# Altium project Rock960 Cape.PrjPcb (part 2 of 2)

## Sheet DC-DC Converters.SchDoc: DC-DC Converters
size B; Organization: Drexel University; Address1: ECE Senior Design; Address2: 2018-2019; Address3: ECE-08; Revision: 1.0; SheetNumber: 7; SheetTotal: 9
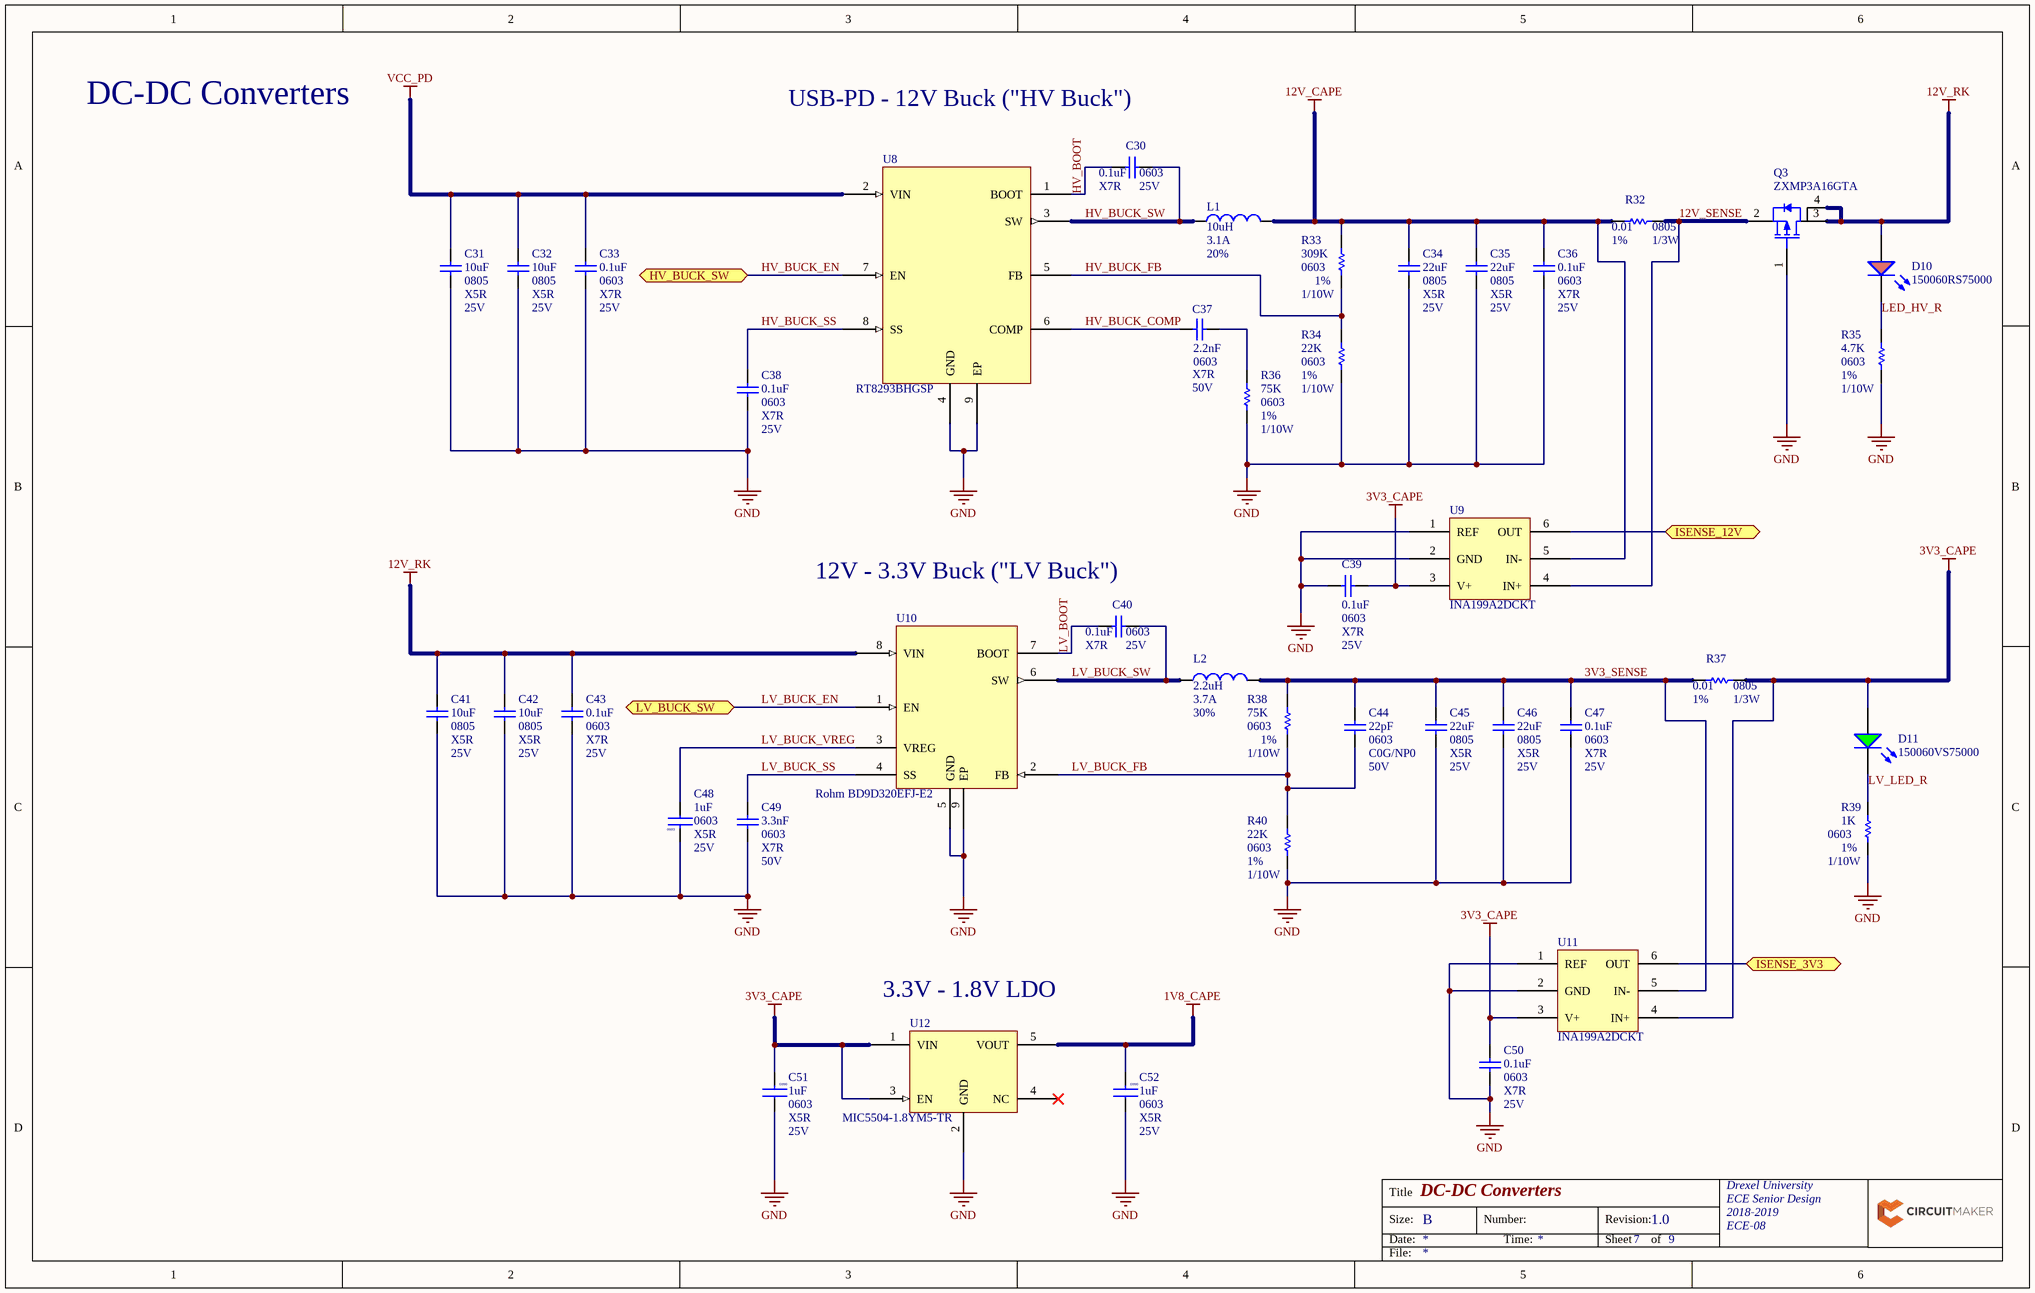
[diagram p6: DC-DC Converters.SchDoc]

### Parts
C30  Dielectric Characteristic: X7R  Voltage Rating (DC): 25V  Capacitance: 0.1uF  Package: 0603  [PCB-8usp83j76ntw2xroyu3n-1]  (hidden comment: Würth Elektronik 885012206071)
C31  Voltage Rating (DC): 25V  Package: 0805  Capacitance: 10uF  Temperature Coefficient: X5R  [Capacitor_0805]  (hidden comment: Murata GRM21BR61E106MA73L)
C32  Voltage Rating (DC): 25V  Package: 0805  Capacitance: 10uF  Temperature Coefficient: X5R  [Capacitor_0805]  (hidden comment: Murata GRM21BR61E106MA73L)
C33  Dielectric Characteristic: X7R  Voltage Rating (DC): 25V  Capacitance: 0.1uF  Package: 0603  [PCB-8usp83j76ntw2xroyu3n-1]  (hidden comment: Würth Elektronik 885012206071)
C34  Case/Package: 0805  Capacitance: 22uF  Temperature Coefficient: X5R  Voltage Rating: 25V  [PCB-sm9io2v4t6ucfy8bcald-1]  (hidden comment: CL21A226MAQNNNE)
C35  Case/Package: 0805  Capacitance: 22uF  Temperature Coefficient: X5R  Voltage Rating: 25V  [PCB-sm9io2v4t6ucfy8bcald-1]  (hidden comment: CL21A226MAQNNNE)
C36  Dielectric Characteristic: X7R  Voltage Rating (DC): 25V  Capacitance: 0.1uF  Package: 0603  [PCB-8usp83j76ntw2xroyu3n-1]  (hidden comment: Würth Elektronik 885012206071)
C37  Capacitance: 2.2nF  Pacakge: 0603  Temperature Coefficient: X7R  Voltage Rating: 50V  [PCB-rt9y6alohkqhfgbzbx9m-1]  (hidden comment: Cap)
C38  Dielectric Characteristic: X7R  Voltage Rating (DC): 25V  Capacitance: 0.1uF  Package: 0603  [PCB-8usp83j76ntw2xroyu3n-1]  (hidden comment: Würth Elektronik 885012206071)
C39  Dielectric Characteristic: X7R  Voltage Rating (DC): 25V  Capacitance: 0.1uF  Package: 0603  [PCB-8usp83j76ntw2xroyu3n-1]  (hidden comment: Würth Elektronik 885012206071)
C40  Dielectric Characteristic: X7R  Voltage Rating (DC): 25V  Capacitance: 0.1uF  Package: 0603  [PCB-8usp83j76ntw2xroyu3n-1]  (hidden comment: Würth Elektronik 885012206071)
C41  Voltage Rating (DC): 25V  Package: 0805  Capacitance: 10uF  Temperature Coefficient: X5R  [Capacitor_0805]  (hidden comment: Murata GRM21BR61E106MA73L)
C42  Voltage Rating (DC): 25V  Package: 0805  Capacitance: 10uF  Temperature Coefficient: X5R  [Capacitor_0805]  (hidden comment: Murata GRM21BR61E106MA73L)
C43  Dielectric Characteristic: X7R  Voltage Rating (DC): 25V  Capacitance: 0.1uF  Package: 0603  [PCB-8usp83j76ntw2xroyu3n-1]  (hidden comment: Würth Elektronik 885012206071)
C44  Capacitance: 22pF  Voltage Rating: 50V  Temperature Coefficient: C0G/NP0  Package: 0603  [PCB-c1bc5fz63nm5dhuj9x7i-1]  (hidden comment: Samsung CL10C220JB8NFNC)
C45  Case/Package: 0805  Capacitance: 22uF  Temperature Coefficient: X5R  Voltage Rating: 25V  [PCB-sm9io2v4t6ucfy8bcald-1]  (hidden comment: CL21A226MAQNNNE)
C46  Case/Package: 0805  Capacitance: 22uF  Temperature Coefficient: X5R  Voltage Rating: 25V  [PCB-sm9io2v4t6ucfy8bcald-1]  (hidden comment: CL21A226MAQNNNE)
C47  Dielectric Characteristic: X7R  Voltage Rating (DC): 25V  Capacitance: 0.1uF  Package: 0603  [PCB-8usp83j76ntw2xroyu3n-1]  (hidden comment: Würth Elektronik 885012206071)
C48  Case/Package: 0603  Dielectric Characteristic: X5R  Capacitance: 1uF  Voltage Rating (DC): 25V  [PCB-bncvufzharetcg4gy1u6-1]  (hidden comment: Taiyo Yuden TMK107BJ105KA-T)
C49  Capacitance: 3.3nF  Case/Package: 0603  Dielectric Characteristic: X7R  Voltage Rating (DC): 50V  [PCB-spmbmairbtzdei53y7wi-1]  (hidden comment: Würth Elektronik 885012206086)
C50  Dielectric Characteristic: X7R  Voltage Rating (DC): 25V  Capacitance: 0.1uF  Package: 0603  [PCB-8usp83j76ntw2xroyu3n-1]  (hidden comment: Würth Elektronik 885012206071)
C51  Case/Package: 0603  Dielectric Characteristic: X5R  Capacitance: 1uF  Voltage Rating (DC): 25V  [PCB-bncvufzharetcg4gy1u6-1]  (hidden comment: Taiyo Yuden TMK107BJ105KA-T)
C52  Case/Package: 0603  Dielectric Characteristic: X5R  Capacitance: 1uF  Voltage Rating (DC): 25V  [PCB-bncvufzharetcg4gy1u6-1]  (hidden comment: Taiyo Yuden TMK107BJ105KA-T)
D10  150060RS75000  [PCB-gaza7c7mdlgwi4y82xs2-1]
D11  150060VS75000  [0603_A]
L1  Inductance: 10uH  Current Rating: 3.1A  Tolerance: 20%  [Inductor]  (hidden comment: Inductor)
L2  Inductance: 2.2uH  Current Rating: 3.7A  Tolerance: 30%  [PCB-fuzgio0l72uhvfuauccx-1]  (hidden comment: Inductor)
Q3  Manufacturer Part Number: ZXMP3A16GTA  [SOT230P700X160-4N]  (hidden comment: SYM-6957a0575e87b690-1)
R32  Package: 0805  Power Rating: 1/3W  Resistance: 0.01  Tolerance: 1%  [PCB-5x7ab7seay4cz0nm4g1d-1]  (hidden comment: RU2012FR010CS)
R33  Case/Package: 0603  Power Rating: 1/10W  Resistance: 309K  Resistance Tolerance: 1%  [RESC1608X55X25LL10T15]  (hidden comment: Yageo RC0603FR-07309KL)
R34  Resistance: 22K  Resistance Tolerance: 1%  Case/Package: 0603  Power Rating: 1/10W  [RESC1608X55X25LL10T15]  (hidden comment: Yageo RC0603FR-0722KL)
R35  Resistance: 4.7K  Package: 0603  Power Rating: 1/10W  Tolerance: 1%  [CAPC1608X90X35NL15T15]  (hidden comment: 4k7)
R36  Case/Package: 0603  Resistance: 75K  Resistance Tolerance: 1%  Power: 1/10W  [BOUR-CR0603-FX-7502ELF_M]  (hidden comment: Bourns CR0603-FX-7502ELF)
R37  Package: 0805  Power Rating: 1/3W  Resistance: 0.01  Tolerance: 1%  [PCB-5x7ab7seay4cz0nm4g1d-1]  (hidden comment: RU2012FR010CS)
R38  Case/Package: 0603  Resistance: 75K  Resistance Tolerance: 1%  Power: 1/10W  [BOUR-CR0603-FX-7502ELF_M]  (hidden comment: Bourns CR0603-FX-7502ELF)
R39  Case/Package: 0603  Power Rating: 1/10W  Resistance: 1K  Resistance Tolerance: 1%  [PCB-rzdzs5ckhrcob8ss0hvn-1]  (hidden comment: Stackpole Electronics RMCF0603FT1K00)
R40  Resistance: 22K  Resistance Tolerance: 1%  Case/Package: 0603  Power Rating: 1/10W  [RESC1608X55X25LL10T15]  (hidden comment: Yageo RC0603FR-0722KL)
U8  RT8293BHGSP  [SOP127P600X175_HS-9N]
U9  INA199A2DCKT  [PCB-fk4u5s6fuzak3ls58m4h-1]
U10  Rohm BD9D320EFJ-E2  [TSOP127P600X100_HS-9N]
U11  INA199A2DCKT  [PCB-fk4u5s6fuzak3ls58m4h-1]
U12  MIC5504-1.8YM5-TR  [PCB-iw8x523xp2xa24mrz5ek-1]

### Ports
HV_BUCK_SW, ISENSE_3V3, ISENSE_12V, LV_BUCK_SW

### Nets
1V8_CAPE: C52.2 U12.5(VOUT)
3V3_CAPE: C39.2 C50.2 C51.2 D11.2(A) R37.2 U9.3(V+) U11.3(V+) U11.4(IN+) U12.1(VIN) U12.3(EN)
12V_CAPE: C34.1 C35.1 C36.2 L1.2 R32.1 R33.2 U9.5(IN-)
12V_RK: C41.2 C42.2 C43.2 D10.2(A) Q3.3(D) Q3.4 U10.8(VIN)
GND: C31.1 C32.1 C33.1 C34.2 C35.2 C36.1 C38.1 C39.1 C41.1 C42.1 C43.1 C45.2 C46.2 C47.1 C48.2 C49.1 C50.1 C51.1 C52.1 Q3.1(G) R34.1 R35.1 R36.1 R39.1 R40.1 U8.4(GND) U8.9(EP) U9.1(REF) U9.2(GND) U10.5(GND) U10.9(EP) U11.1(REF) U11.2(GND) U12.2(GND)
VCC_PD: C31.2 C32.2 C33.2 U8.2(VIN)
3V3_SENSE: C44.2 C45.1 C46.1 C47.2 L2.2 R37.1 R38.2 U11.5(IN-)
12V_SENSE: Q3.2(S) R32.2 U9.4(IN+)
AP_PA5_ADC1_5: U9.6(OUT) ; port ISENSE_12V
AP_PB1_ADC1_9: U11.6(OUT) ; port ISENSE_3V3
HV_BOOT: C30.1 U8.1(BOOT)
HV_BUCK_COMP: C37.2 U8.6(COMP)
HV_BUCK_EN: U8.7(EN) ; port HV_BUCK_SW
HV_BUCK_FB: R33.1 R34.2 U8.5(FB)
HV_BUCK_SS: C38.2 U8.8(SS)
HV_BUCK_SW: C30.2 L1.1 U8.3(SW)
LED_HV_R: D10.1(K) R35.2
LV_BOOT: C40.1 U10.7(BOOT)
LV_BUCK_EN: U10.1(EN) ; port LV_BUCK_SW
LV_BUCK_FB: C44.1 R38.1 R40.2 U10.2(FB)
LV_BUCK_SS: C49.2 U10.4(SS)
LV_BUCK_SW: C40.2 L2.1 U10.6(SW)
LV_BUCK_VREG: C48.1 U10.3(VREG)
LV_LED_R: D11.1(K) R39.2
NetC37_1: C37.1 R36.2

Not connected (* = marked no-connect by the designer): U12 4(NC)*

### Notes on the sheet
- DC-DC Converters
- USB-PD - 12V Buck ("HV Buck")
- (near C40) 12V - 3.3V Buck ("LV Buck")
- (near U12) 3.3V - 1.8V LDO
- Title
- Size:
- Date:
- B
- Number:
- Time:
- Revision:
- Sheet
- of
- File:

### Library data of the parts
C30 C33 C36 C38-C40 C43 C47 C50 = CMP-034ac9768ab0dc8d-1: as C59 on sheet IO Level Shifters; RoHS: Compliant; Capacitance Tolerance: ±10%; OctopartID: 034ac9768ab0dc8d; Packaging: Cut Tape (CT); Octopart URL: http://octopart.com/885012206071-w%C3%BCrth+elektronik-53914780; Manufacturer Part Number: 885012206071
C31 C32 C41 C42 = CMP-3dadf66f6462e26a-3: 0805 25 V 10 uF ±20% Tolerance X5R Multilayer Ceramic Capacitor; Case/Package (SI): 2012; Size-Length: 2.00 mm; OctopartID: 3dadf66f6462e26a; RoHS: Compliant; Lifecycle Status: Active
C34 C35 C45 C46 = CMP-38b9f0cfc974e77e-4: Cap Multilayer Ceramic 0805 22uF 25V ±20% X5R CL21 Series; Lead-Free Status: Lead Free; Capacitance Tolerance: ±20%; Octopart URL: https://octopart.com/cl21a226maqnnne-samsung-24958123; Mounting Style: Surface Mount; Packaging: Tape & Reel (TR)
C37 = CMP-41698a7525199eae-1: Cap Ceramic 0.0022uF 50V X7R 10% SMD 0603 OMD-CAP with FlexiTerm 125C T/R; Octopart URL: https://octopart.com/cl10b222kb8wpnc-samsung-35012886
C44 = CMP-3812f064c92be7d5-1: Cap Ceramic 22pF 50V C0G 5% SMD 0603 125°C Paper T/R; Lead-Free Status: Lead Free; Octopart URL: https://octopart.com/cl10c220jb8nfnc-samsung-24958047; Manufacturer Part Number: CL10C220JB8NFNC; RoHS: Compliant; OctopartID: 3812f064c92be7d5
C48 C51 C52 = CMP-ac4e65478e587389-1: as C2 on sheet USB Type C Power Controller; Octopart URL: http://octopart.com/tmk107bj105ka-t-taiyo+yuden-198512; Packaging: Cut Tape (CT); Size-Width: 800 µm; Halogen Free Status: Halogen Free; Size-Length: 1.60 mm; Capacitance Tolerance: ±10%; OctopartID: ac4e65478e587389; Size-Height: 800 µm; Mounting Style: Surface Mount; Manufacturer Part Number: TMK107BJ105KA-T; Lifecycle Status: Active; Number of Pins: 2; RoHS: Compliant
C49 = CMP-e361295d6aac3ca6-1: Cap, Mlcc, X7r, 3300Pf, 50V, 0603; Capacitance Tolerance: ±10%; Octopart URL: https://octopart.com/885012206086-w%C3%BCrth+elektronik-53914795; Manufacturer Part Number: 885012206086; Mounting Style: Surface Mount; Operating Temperature: -55.0 °C (min); Packaging: Cut Tape (CT); RoHS: Compliant; OctopartID: e361295d6aac3ca6
D10 = CMP-12518859-4: Standard LEDs - SMD WL-SMCW SMDMono TpVw Waterclr 0603 Red; Luminous Intensity: 250 mcd; Viewing Angle: 140 °; Forward Voltage: 2.00 V; Case/Package: 0603; Manufacturer Part Number: 150060RS75000; Packaging: Cut Tape (CT); Octopart URL: https://octopart.com/150060rs75000-w%C3%BCrth+elektronik-29717776; Mounting Style: Surface Mount; REACH SVHC Compliance: No SVHC; OctopartID: 47368ff9174098f1; Color: Red
D11 = CMP-12518862-3: SMD mono-color Chip LED, WL-SMCW, Bright Green; Forward Voltage: 2.0 V; Luminous Intensity: 0.04 cd; Viewing Angle: 140 °; Octopart Url: https://octopart.com/150060vs75000-w%C3%BCrth+elektronik-29717778; OctopartID: 8ccb4404dcbf530c; REACH SVHC Compliance: No SVHC; RoHS: Compliant; Manufacturer Part Number: 150060VS75000
L1 = CMP-f52f3c4e3cb22ae8-2: Inductor Power Shielded Wirewound 10uH 20% 100KHz Ferrite 3.1A 44.2mOhm DCR 3131 T/R; Octopart URL: http://octopart.com/nr8040t100m-taiyo+yuden-7073019; OctopartID: f52f3c4e3cb22ae8
L2 = CMP-7545bccc63e2aa82-1: Inductor Power Shielded Wirewound 2.2uH 30% 100KHz Ferrite 3.7A 26mOhm DCR 2424 T/R; Manufacturer Part Number: NR6028T2R2N; Self Resonant Frequency: 68.0 MHz; Packaging: Cut Tape (CT); RoHS: Compliant; Number of Pins: 2; OctopartID: 7545bccc63e2aa82; Lifecycle Status: Active; Mounting Style: Surface Mount; Halogen Free Status: Halogen Free
Q3 = CMP-6957a0575e87b690-4: Trans MOSFET P-CH 30V 7.5A Automotive 4-Pin(3+Tab) SOT-223 T/R; Current Rating: -7.50 A; Rise Time: 3.82 ns; Drain to Source Voltage (Vds): 30.0 V; Power Dissipation: 2.00 W; Drain to Source Resistance (on) (Rds): 45.0 mΩ; Continuous Drain Current (Ids): 7.50 A; Voltage Rating (DC): -30.0 V; Lifecycle Status: Active; Octopart URL: https://octopart.com/zxmp3a16gta-diodes+inc.-660150; RoHS: Compliant; Case/Package: SOT-223; OctopartID: 6957a0575e87b690; Mounting Style: Surface Mount
R32 R37 = CMP-a19069208eb37e57-1: Resistor, 0805, 10mohm, 0.33w, 1/3w, 600ppm, 1%; OctopartID: a19069208eb37e57
R33 = CMP-1853482-2: RES SMD 309K OHM 1% 1/10W 0603; Lead-Free Status: Lead Free; Voltage Rating (DC): 50.0 V; Manufacturer Part Number: RC0603FR-07309KL; Mounting Style: Surface Mount; Octopart Url: https://octopart.com/rc0603fr-07309kl-yageo-1213852; OctopartID: a053694b00a97f94; RoHS: Compliant; Size-Height: 0.00045 m; Size-Length: 0.0016 m; Size-Width: 0.0008 m
R34 R40 = CMP-1853446-5: as R65 on sheet IO Level Shifters; Number of Pins: 2; Size-Height: 450 µm; PackageDescription: 2-Pin Surface Mount Device, Body 1.6 x 0.8 mm; Size-Width: 800 µm; Seller Landing  Url: https://octopart-clicks.com/click/track?country=US&ak=8157f166&sig=0952a08&sid=5489&ppid=40952860&vpid=270386233&ct=offers; DatasheetVersion: Rev. 4, 02/2016; PackageReference: 0603; Size-Length: 1.60 mm; RoHS: Compliant; Mounting Style: Surface Mount; OctopartID: 2162ea18e018fea5; Manufacturer Part Number: RC0603FR-0722KL; Packaging: Cut Tape (CT), Tape & Reel (TR); Octopart Url: http://octopart.com/rc0603fr-0722kl-yageo-40952860; REACH SVHC Compliance: No SVHC
R35 = CMP-3ca7f596181de360-9: Res Thick Film 0603 4.7K Ohm 1% 1/10W ±100ppm/°C Molded SMD SMD Paper Tape on Plastic Reel
R36 R38 = CMP-3652844-3: Thick Film Resistors - SMD 75K ohm 1%; Octopart Url: https://octopart.com/cr0603-fx-7502elf-bourns-3881290; OctopartID: 4de084d151cc9227; RoHS: Compliant; Size-Length: 0.0016002 m; Size-Thickness: 0.0004572 m; Size-Width: 0.0007874 m; Manufacturer Part Number: CR0603-FX-7502ELF
R39 = CMP-fdb3359cf2042274-2: as R53 on sheet USB to UART Bridge; Packaging: Tape & Reel (TR); Octopart URL: http://octopart.com/rmcf0603ft1k00-stackpole+electronics-19213009; Mounting Style: Surface Mount; OctopartID: fdb3359cf2042274; RoHS: Compliant; Manufacturer Part Number: RMCF0603FT1K00
U8 = CMP-92cc5aea56b44d0b-1: RT8293B Series 23 V 3 A 1.4 MHz Synchronous Step-Down Converter - SOIC-8EP; Lead-Free Status: Lead Free; Octopart URL: https://octopart.com/rt8293bhgsp-richtek-19718430; Manufacturer Part Number: RT8293BHGSP; Operating Temperature: -40.0 °C (min); Packaging: Cut Tape (CT); RoHS: Compliant; OctopartID: 92cc5aea56b44d0b
U9 U11 = CMP-a8b860a96634777f-1: 26-V, Bi-Directional, Zero-Drift, Low- or High-Side, Voltage Output Current Shunt Monitor 6-SC70 -40 to 125; Supply Current: 65.0 µA; Case/Package: SOT-363; Octopart URL: http://octopart.com/ina199a1dckr-texas+instruments-18607082; REACH SVHC Compliance: No SVHC; RoHS: Compliant; OctopartID: a8b860a96634777f; Number of Pins: 6
U10 = CMP-d72c1fff612d08eb-2: DC-DC Switching Buck Step Down Regulator, Adjustable, 4.5V-18Vin, 765mV-7Vout, 3Aout, HTSOP-8; Output Voltage: 7.00 V (max); Number of Outputs: 1; Octopart URL: https://octopart.com/bd9d320efj-e2-rohm-31036263
U12 = CMP-8e1b44eafdba51dc-1: Voltage regulator; LDO, fixed; 1.8V; 0.3A; SOT23-5; SMD; -40÷125°C; Output Current: 300 mA; Octopart URL: https://octopart.com/mic5504-1.8ym5-tr-microchip-66803399; Manufacturer Part Number: MIC5504-1.8YM5-TR; Case/Package: SOT-23; Lifecycle Status: Not Listed by Manufacturer; Mounting Style: Surface Mount; Operating Temperature: -40.0 °C (min); Packaging: Cut Tape (CT); RoHS: Compliant; OctopartID: 8e1b44eafdba51dc

## Sheet STM32F4.SchDoc: STM32F4
size B; Organization: Drexel University; Address1: ECE Senior Design; Address2: 2018-2019; Address3: ECE-08; Revision: 1.0; SheetNumber: 8; SheetTotal: 9
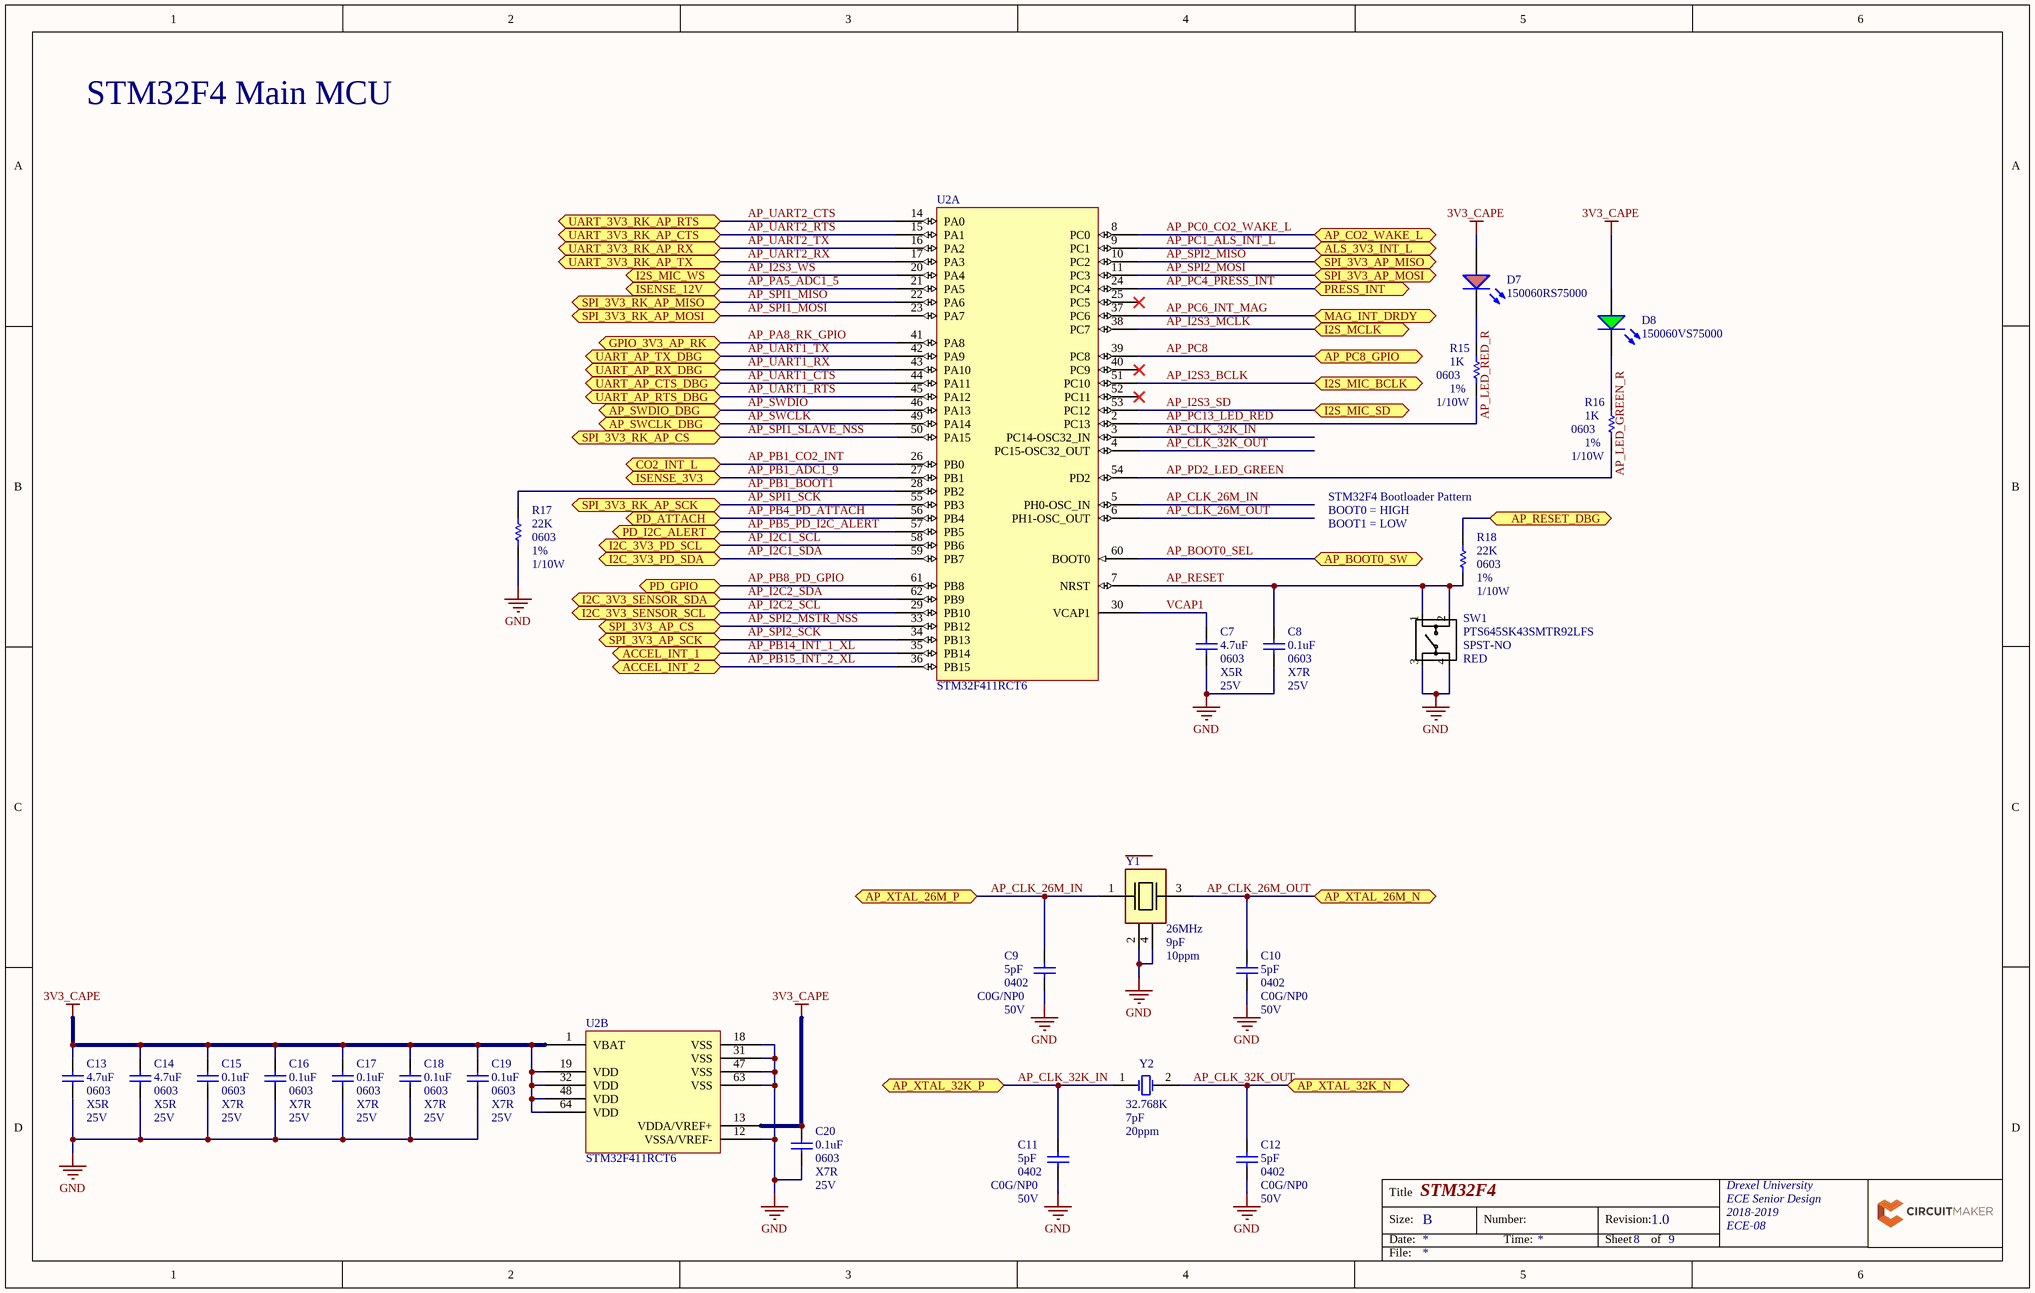
[diagram p7: STM32F4.SchDoc]

### Parts
C7  Capacitance: 4.7uF  Case/Package: 0603  Dielectric Characteristic: X5R  Voltage Rating (DC): 25V  [CAPC1608X90X35ML10T15]  (hidden comment: Murata GRM188R61E475KE11D)
C8  Dielectric Characteristic: X7R  Voltage Rating (DC): 25V  Capacitance: 0.1uF  Package: 0603  [PCB-8usp83j76ntw2xroyu3n-1]  (hidden comment: Würth Elektronik 885012206071)
C9  Capacitance: 5pF  Case/Package: 0402  Dielectric Characteristic: C0G/NP0  Voltage Rating (DC): 50V  [CAPC1005X56X25ML10T15]  (hidden comment: AVX Interconnect / Elco 04025A5R0CAT2A)
C10  Capacitance: 5pF  Case/Package: 0402  Dielectric Characteristic: C0G/NP0  Voltage Rating (DC): 50V  [CAPC1005X56X25ML10T15]  (hidden comment: AVX Interconnect / Elco 04025A5R0CAT2A)
C11  Capacitance: 5pF  Case/Package: 0402  Dielectric Characteristic: C0G/NP0  Voltage Rating (DC): 50V  [CAPC1005X56X25ML10T15]  (hidden comment: AVX Interconnect / Elco 04025A5R0CAT2A)
C12  Capacitance: 5pF  Case/Package: 0402  Dielectric Characteristic: C0G/NP0  Voltage Rating (DC): 50V  [CAPC1005X56X25ML10T15]  (hidden comment: AVX Interconnect / Elco 04025A5R0CAT2A)
C13  Capacitance: 4.7uF  Case/Package: 0603  Dielectric Characteristic: X5R  Voltage Rating (DC): 25V  [CAPC1608X90X35ML10T15]  (hidden comment: Murata GRM188R61E475KE11D)
C14  Capacitance: 4.7uF  Case/Package: 0603  Dielectric Characteristic: X5R  Voltage Rating (DC): 25V  [CAPC1608X90X35ML10T15]  (hidden comment: Murata GRM188R61E475KE11D)
C15  Dielectric Characteristic: X7R  Voltage Rating (DC): 25V  Capacitance: 0.1uF  Package: 0603  [PCB-8usp83j76ntw2xroyu3n-1]  (hidden comment: Würth Elektronik 885012206071)
C16  Dielectric Characteristic: X7R  Voltage Rating (DC): 25V  Capacitance: 0.1uF  Package: 0603  [PCB-8usp83j76ntw2xroyu3n-1]  (hidden comment: Würth Elektronik 885012206071)
C17  Dielectric Characteristic: X7R  Voltage Rating (DC): 25V  Capacitance: 0.1uF  Package: 0603  [PCB-8usp83j76ntw2xroyu3n-1]  (hidden comment: Würth Elektronik 885012206071)
C18  Dielectric Characteristic: X7R  Voltage Rating (DC): 25V  Capacitance: 0.1uF  Package: 0603  [PCB-8usp83j76ntw2xroyu3n-1]  (hidden comment: Würth Elektronik 885012206071)
C19  Dielectric Characteristic: X7R  Voltage Rating (DC): 25V  Capacitance: 0.1uF  Package: 0603  [PCB-8usp83j76ntw2xroyu3n-1]  (hidden comment: Würth Elektronik 885012206071)
C20  Dielectric Characteristic: X7R  Voltage Rating (DC): 25V  Capacitance: 0.1uF  Package: 0603  [PCB-8usp83j76ntw2xroyu3n-1]  (hidden comment: Würth Elektronik 885012206071)
D7  150060RS75000  [PCB-gaza7c7mdlgwi4y82xs2-1]
D8  150060VS75000  [0603_A]
R15  Case/Package: 0603  Power Rating: 1/10W  Resistance: 1K  Resistance Tolerance: 1%  [PCB-rzdzs5ckhrcob8ss0hvn-1]  (hidden comment: Stackpole Electronics RMCF0603FT1K00)
R16  Case/Package: 0603  Power Rating: 1/10W  Resistance: 1K  Resistance Tolerance: 1%  [PCB-rzdzs5ckhrcob8ss0hvn-1]  (hidden comment: Stackpole Electronics RMCF0603FT1K00)
R17  Resistance: 22K  Resistance Tolerance: 1%  Case/Package: 0603  Power Rating: 1/10W  [RESC1608X55X25LL10T15]  (hidden comment: Yageo RC0603FR-0722KL)
R18  Resistance: 22K  Resistance Tolerance: 1%  Case/Package: 0603  Power Rating: 1/10W  [RESC1608X55X25LL10T15]  (hidden comment: Yageo RC0603FR-0722KL)
SW1  Manufacturer Part Number: PTS645SK43SMTR92LFS  Contacts Type: SPST-NO  [PCB-2l25iuk5dcek232nr8ss-1]  (hidden comment: C&K Components PTS645SK43SMTR92LFS)
U2  STM32F411RCT6  [STM32F411RCT6]  (parts A,B of 2)
Y1  Frequency: 26MHz  Load Capacitance: 9pF  Tolerance: 10ppm  [PCB-rtr9ii3g7ib08042rvg2-1]  (hidden comment: EPSON TSX-3225 26.0000MF09Z-AC0)
Y2  Frequency: 32.768K  Load Capacitance: 7pF  Tolerance: 20ppm  [PCB-1zp5wd1v5813cd8flxka-1]  (hidden comment: SYM-533e9910b4df8cf9-1)

### Ports
ACCEL_INT_1, ACCEL_INT_2, ALS_3V3_INT_L, AP_BOOT0_SW, AP_CO2_WAKE_L, AP_PC8_GPIO, AP_RESET_DBG, AP_SWCLK_DBG, AP_SWDIO_DBG, AP_XTAL_26M_N, AP_XTAL_26M_P, AP_XTAL_32K_N, AP_XTAL_32K_P, CO2_INT_L, GPIO_3V3_AP_RK, I2C_3V3_PD_SCL (bidir), I2C_3V3_PD_SDA (bidir), I2C_3V3_SENSOR_SCL, I2C_3V3_SENSOR_SDA, I2S_MCLK, I2S_MIC_BCLK, I2S_MIC_SD, I2S_MIC_WS, ISENSE_3V3, ISENSE_12V, MAG_INT_DRDY, PD_ATTACH, PD_GPIO, PD_I2C_ALERT, PRESS_INT, SPI_3V3_AP_CS, SPI_3V3_AP_MISO, SPI_3V3_AP_MOSI, SPI_3V3_AP_SCK, SPI_3V3_RK_AP_CS, SPI_3V3_RK_AP_MISO, SPI_3V3_RK_AP_MOSI, SPI_3V3_RK_AP_SCK, UART_3V3_RK_AP_CTS (bidir), UART_3V3_RK_AP_RTS (bidir), UART_3V3_RK_AP_RX, UART_3V3_RK_AP_TX, UART_AP_CTS_DBG, UART_AP_RTS_DBG, UART_AP_RX_DBG, UART_AP_TX_DBG

### Nets
3V3_CAPE: C13.2 C14.2 C15.2 C16.2 C17.2 C18.2 C19.2 C20.2 D7.2(A) D8.2(A) U2.1(VBAT) U2.13(VDDA/VREF+) U2.19(VDD) U2.32(VDD) U2.48(VDD) U2.64(VDD)
GND: C7.1 C8.1 C9.1 C10.1 C11.1 C12.1 C13.1 C14.1 C15.1 C16.1 C17.1 C18.1 C19.1 C20.1 R17.1 SW1.3 SW1.4 U2.12(VSSA/VREF-) U2.18(VSS) U2.31(VSS) U2.47(VSS) U2.63(VSS) Y1.2(GND) Y1.4(GND)
AP_BOOT0_SEL: U2.60(BOOT0) ; port AP_BOOT0_SW
AP_CLK_26M_IN: C9.2 U2.5(PH0-OSC_IN) Y1.1(X1) ; port AP_XTAL_26M_P
AP_CLK_26M_OUT: C10.2 U2.6(PH1-OSC_OUT) Y1.3(X2) ; port AP_XTAL_26M_N
AP_CLK_32K_IN: C11.2 U2.3(PC14-OSC32_IN) Y2.1(X1) ; port AP_XTAL_32K_P
AP_CLK_32K_OUT: C12.2 U2.4(PC15-OSC32_OUT) Y2.2(X2) ; port AP_XTAL_32K_N
AP_I2C1_SCL: U2.58(PB6) ; port I2C_3V3_PD_SCL
AP_I2C1_SDA: U2.59(PB7) ; port I2C_3V3_PD_SDA
AP_I2C2_SCL: U2.29(PB10) ; port I2C_3V3_SENSOR_SCL
AP_I2C2_SDA: U2.62(PB9) ; port I2C_3V3_SENSOR_SDA
AP_I2S3_BCLK: U2.51(PC10) ; port I2S_MIC_BCLK
AP_I2S3_MCLK: U2.38(PC7) ; port I2S_MCLK
AP_I2S3_SD: U2.53(PC12) ; port I2S_MIC_SD
AP_I2S3_WS: U2.20(PA4) ; port I2S_MIC_WS
AP_LED_GREEN_R: D8.1(K) R16.2
AP_LED_RED_R: D7.1(K) R15.2
AP_PA5_ADC1_5: U2.21(PA5) ; port ISENSE_12V
AP_PA8_RK_GPIO: U2.41(PA8) ; port GPIO_3V3_AP_RK
AP_PB1_ADC1_9: U2.27(PB1) ; port ISENSE_3V3
AP_PB1_BOOT1: R17.2 U2.28(PB2)
AP_PB1_CO2_INT: U2.26(PB0) ; port CO2_INT_L
AP_PB4_PD_ATTACH: U2.56(PB4) ; port PD_ATTACH
AP_PB5_PD_I2C_ALERT: U2.57(PB5) ; port PD_I2C_ALERT
AP_PB8_PD_GPIO: U2.61(PB8) ; port PD_GPIO
AP_PB14_INT_1_XL: U2.35(PB14) ; port ACCEL_INT_1
AP_PB15_INT_2_XL: U2.36(PB15) ; port ACCEL_INT_2
AP_PC0_CO2_WAKE_L: U2.8(PC0) ; port AP_CO2_WAKE_L
AP_PC1_ALS_INT_L: U2.9(PC1) ; port ALS_3V3_INT_L
AP_PC4_PRESS_INT: U2.24(PC4) ; port PRESS_INT
AP_PC6_INT_MAG: U2.37(PC6) ; port MAG_INT_DRDY
AP_PC8: U2.39(PC8) ; port AP_PC8_GPIO
AP_PC13_LED_RED: R15.1 U2.2(PC13)
AP_PD2_LED_GREEN: R16.1 U2.54(PD2)
AP_RESET: C8.2 R18.1 SW1.1 SW1.2 U2.7(NRST)
AP_RESET_HDR: R18.2 ; port AP_RESET_DBG
AP_SPI1_MISO: U2.22(PA6) ; port SPI_3V3_RK_AP_MISO
AP_SPI1_MOSI: U2.23(PA7) ; port SPI_3V3_RK_AP_MOSI
AP_SPI1_SCK: U2.55(PB3) ; port SPI_3V3_RK_AP_SCK
AP_SPI1_SLAVE_NSS: U2.50(PA15) ; port SPI_3V3_RK_AP_CS
AP_SPI2_MISO: U2.10(PC2) ; port SPI_3V3_AP_MISO
AP_SPI2_MOSI: U2.11(PC3) ; port SPI_3V3_AP_MOSI
AP_SPI2_MSTR_NSS: U2.33(PB12) ; port SPI_3V3_AP_CS
AP_SPI2_SCK: U2.34(PB13) ; port SPI_3V3_AP_SCK
AP_SWCLK: U2.49(PA14) ; port AP_SWCLK_DBG
AP_SWDIO: U2.46(PA13) ; port AP_SWDIO_DBG
AP_UART1_CTS: U2.44(PA11) ; port UART_AP_CTS_DBG
AP_UART1_RTS: U2.45(PA12) ; port UART_AP_RTS_DBG
AP_UART1_RX: U2.43(PA10) ; port UART_AP_RX_DBG
AP_UART1_TX: U2.42(PA9) ; port UART_AP_TX_DBG
AP_UART2_CTS: U2.14(PA0) ; port UART_3V3_RK_AP_RTS
AP_UART2_RTS: U2.15(PA1) ; port UART_3V3_RK_AP_CTS
AP_UART2_RX: U2.17(PA3) ; port UART_3V3_RK_AP_TX
AP_UART2_TX: U2.16(PA2) ; port UART_3V3_RK_AP_RX
VCAP1: C7.2 U2.30(VCAP1)

Not connected (* = marked no-connect by the designer): U2 25(PC5)* 40(PC9)* 52(PC11)*

### Notes on the sheet
- STM32F4 Main MCU
- (near R18) STM32F4 Bootloader Pattern
- BOOT0 = HIGH
- BOOT1 = LOW
- (near SW1) RED
- Title
- Size:
- Date:
- B
- Number:
- Time:
- Revision:
- Sheet
- of
- File:

### Library data of the parts
C7 C13 C14 = CMP-8856396-4: CAP CER 4.7UF 25V 10% X5R 0603; Capacitance Tolerance: ±10%; Lifecycle Status: Active; Octopart Url: https://octopart.com/grm188r61e475ke11d-murata-26982327; OctopartID: 0176c9e793a7deb1; Packaging: Cut Tape (CT); REACH SVHC Compliance: No SVHC; RoHS: Compliant; Size-Length: 0.0016 m; Size-Thickness: 0.0008 m; Size-Width: 0.0008 m; Manufacturer Part Number: GRM188R61E475KE11D
C8 C15-C20 = CMP-034ac9768ab0dc8d-1: Multilayer Ceramic Capacitor, WCAP-CSGP Series, 0.1 F, 10%, X7R, 25 V, 0603 [1608 Metric]; RoHS: Compliant; Capacitance Tolerance: ±10%; OctopartID: 034ac9768ab0dc8d; Packaging: Cut Tape (CT); Octopart URL: http://octopart.com/885012206071-w%C3%BCrth+elektronik-53914780; Manufacturer Part Number: 885012206071
C9-C12 = CMP-173336-2: Multilayer Ceramic Capacitors MLCC - SMD/SMT 0402 5pF 50volts C0G +/-0.25pF; Lead-Free Status: Lead Free; Octopart Url: https://octopart.com/04025a5r0cat2a-avx+interconnect+%2F+elco-9080176; OctopartID: 46528fd2ee449995; Packaging: Tape; RoHS: Compliant; Manufacturer Part Number: 04025A5R0CAT2A
D7 = CMP-12518859-4: Standard LEDs - SMD WL-SMCW SMDMono TpVw Waterclr 0603 Red; Luminous Intensity: 250 mcd; Viewing Angle: 140 °; Forward Voltage: 2.00 V; Case/Package: 0603; Manufacturer Part Number: 150060RS75000; Packaging: Cut Tape (CT); Octopart URL: https://octopart.com/150060rs75000-w%C3%BCrth+elektronik-29717776; Mounting Style: Surface Mount; REACH SVHC Compliance: No SVHC; OctopartID: 47368ff9174098f1; Color: Red
D8 = CMP-12518862-3: SMD mono-color Chip LED, WL-SMCW, Bright Green; Forward Voltage: 2.0 V; Luminous Intensity: 0.04 cd; Viewing Angle: 140 °; Octopart Url: https://octopart.com/150060vs75000-w%C3%BCrth+elektronik-29717778; OctopartID: 8ccb4404dcbf530c; REACH SVHC Compliance: No SVHC; RoHS: Compliant; Manufacturer Part Number: 150060VS75000
R15 R16 = CMP-fdb3359cf2042274-2: RMCF Series 0603 0.1 W 1 kOhm ±1 % ±100 ppm/°C SMT Thick Film Chip Resistor; Lead-Free Status: Lead Free; Packaging: Tape & Reel (TR); Octopart URL: http://octopart.com/rmcf0603ft1k00-stackpole+electronics-19213009; Mounting Style: Surface Mount; OctopartID: fdb3359cf2042274; RoHS: Compliant; Manufacturer Part Number: RMCF0603FT1K00
R17 R18 = CMP-1853446-5: Chip Resistor, 22 KOhm, +/- 1%, 0.1 W, -55 to 155 degC, 0603 (1608 Metric), RoHS, Tape and Reel; Voltage Rating (DC): 50.0 V; Lead-Free Status: Lead Free; Case/Package (SI): 1608; Number of Pins: 2; Size-Height: 450 µm; PackageDescription: 2-Pin Surface Mount Device, Body 1.6 x 0.8 mm; Size-Width: 800 µm; Seller Landing  Url: https://octopart-clicks.com/click/track?country=US&ak=8157f166&sig=0952a08&sid=5489&ppid=40952860&vpid=270386233&ct=offers; DatasheetVersion: Rev. 4, 02/2016; PackageReference: 0603; Size-Length: 1.60 mm; RoHS: Compliant; Mounting Style: Surface Mount; OctopartID: 2162ea18e018fea5; Manufacturer Part Number: RC0603FR-0722KL; Packaging: Cut Tape (CT), Tape & Reel (TR); Octopart Url: http://octopart.com/rc0603fr-0722kl-yageo-40952860; REACH SVHC Compliance: No SVHC
SW1 = CMP-8f9845df1015505f-1: Switch Tactile N.O SPST Round Button Gull Wing 0.05A 12VDC 100000Cycle 2.55N SMD T/R; Lead-Free Status: Lead Free; Octopart URL: https://octopart.com/pts645sk43smtr92lfs-c%26k+components-55425771; Mounting Style: Surface Mount; Packaging: Tape & Reel (TR); REACH SVHC Compliance: No SVHC; RoHS: Compliant; Size-Height: 4.30 mm; OctopartID: 8f9845df1015505f
U2 = CMP-a3dd6807c7d17c1a-3: 32 Bit Microcontroller, Batch Acquisition Mode, ARM Cortex-M4, 100 MHz, 256 KB, 128 KB, 64, LQFP
Y1 = CMP-fc563492a5642391-2: Crystal 26.00 Mhz 9.0pf Smd; Manufacturer Part Number: TSX-3225 26.0000MF09Z-AC0
Y2 = CMP-533e9910b4df8cf9-1: Crystal 0.032768MHz ±20ppm (Tol) 7pF FUND 70000Ohm 2-Pin SMD T/R; Manufacturer Part Number: FC-135 32.7680KA-AG0; Packaging: Reel; RoHS: Compliant; OctopartID: 533e9910b4df8cf9; Octopart URL: http://octopart.com/fc-135+32.7680ka-ag0-epson-52740743

## Sheet Air Quality Sensors.SchDoc: Air Quality Sensors
size B; CompanyName: Drexel University; Organization: Drexel University; Address1: ECE Senior Design; Address2: 2018-2019; Address3: ECE-08; Revision: 1.0; SheetNumber: 9; SheetTotal: 10
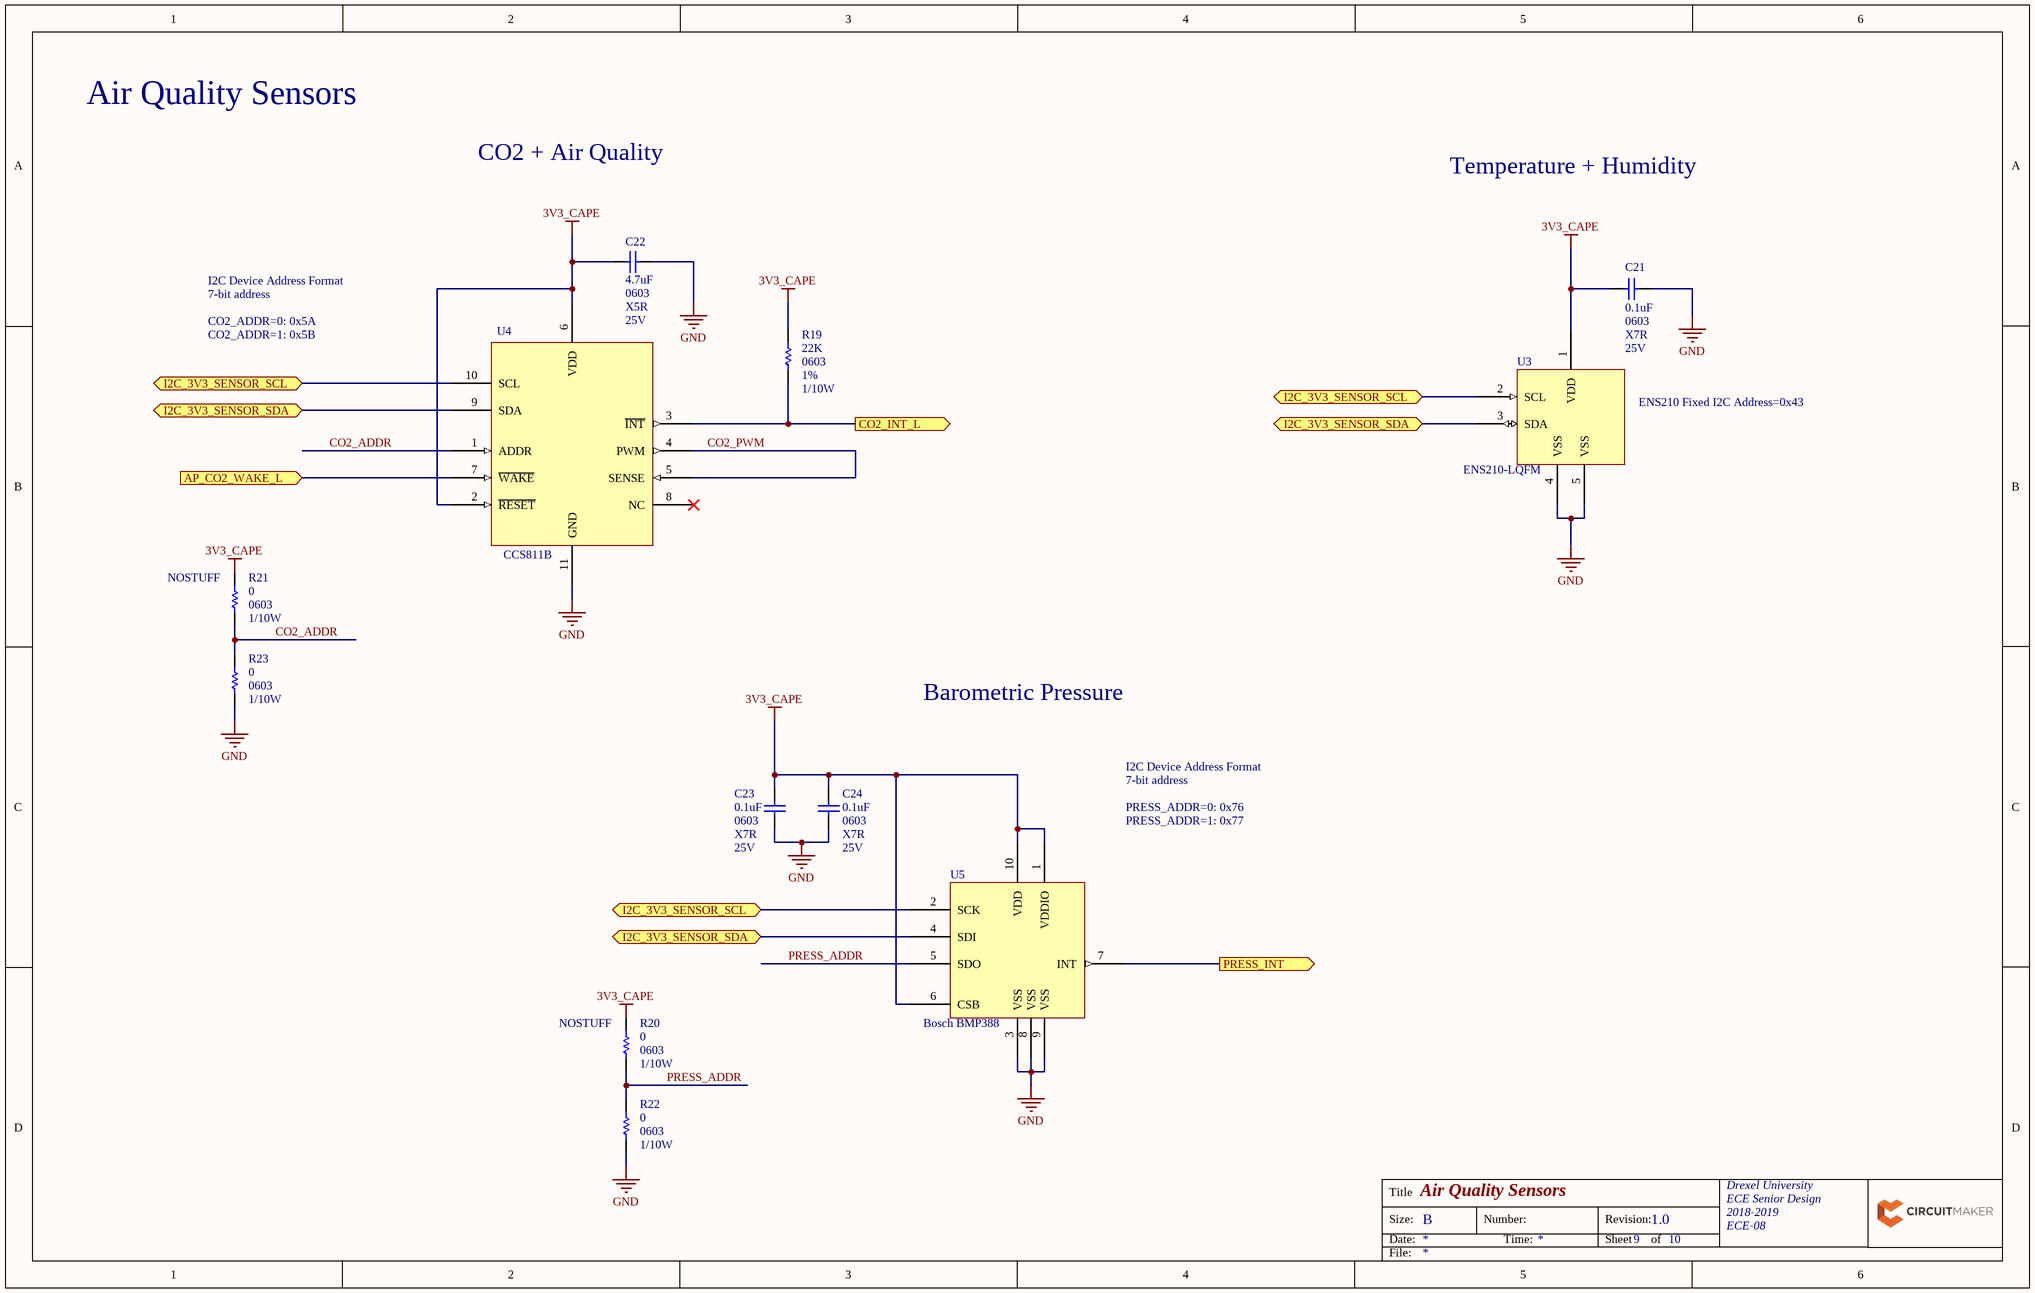
[diagram p8: Air Quality Sensors.SchDoc]

### Parts
C21  Dielectric Characteristic: X7R  Voltage Rating (DC): 25V  Capacitance: 0.1uF  Package: 0603  [PCB-8usp83j76ntw2xroyu3n-1]  (hidden comment: Würth Elektronik 885012206071)
C22  Capacitance: 4.7uF  Case/Package: 0603  Dielectric Characteristic: X5R  Voltage Rating (DC): 25V  [CAPC1608X90X35ML10T15]  (hidden comment: Murata GRM188R61E475KE11D)
C23  Dielectric Characteristic: X7R  Voltage Rating (DC): 25V  Capacitance: 0.1uF  Package: 0603  [PCB-8usp83j76ntw2xroyu3n-1]  (hidden comment: Würth Elektronik 885012206071)
C24  Dielectric Characteristic: X7R  Voltage Rating (DC): 25V  Capacitance: 0.1uF  Package: 0603  [PCB-8usp83j76ntw2xroyu3n-1]  (hidden comment: Würth Elektronik 885012206071)
R19  Resistance: 22K  Resistance Tolerance: 1%  Case/Package: 0603  Power Rating: 1/10W  [RESC1608X55X25LL10T15]  (hidden comment: Yageo RC0603FR-0722KL)
R20  Supplier Device Package: 0603  Resistance: 0  Power: 1/10W  [PCB-vghjuybc2rzv8513tm8h-1]  (hidden comment: Res1)
R21  Supplier Device Package: 0603  Resistance: 0  Power: 1/10W  [PCB-vghjuybc2rzv8513tm8h-1]  (hidden comment: Res1)
R22  Supplier Device Package: 0603  Resistance: 0  Power: 1/10W  [PCB-vghjuybc2rzv8513tm8h-1]  (hidden comment: Res1)
R23  Supplier Device Package: 0603  Resistance: 0  Power: 1/10W  [PCB-vghjuybc2rzv8513tm8h-1]  (hidden comment: Res1)
U3  ENS210-LQFM  [DFN95P200X80-4N]
U4  CCS811B  [CCS811B]
U5  Bosch BMP388  [BMP388]

### Ports
AP_CO2_WAKE_L (in), CO2_INT_L (out), I2C_3V3_SENSOR_SCL, I2C_3V3_SENSOR_SDA, PRESS_INT (out)

### Nets
3V3_CAPE: C21.1 C22.2 C23.2 C24.2 R19.2 R20.2 R21.2 U3.1(VDD) U4.2(~{RESET}) U4.6(VDD) U5.1(VDDIO) U5.6(CSB) U5.10(VDD)
GND: C21.2 C22.1 C23.1 C24.1 R22.1 R23.1 U3.4(VSS) U3.5(VSS) U4.11(GND) U5.3(VSS) U5.8(VSS) U5.9(VSS)
AP_I2C2_SCL: U3.2(SCL) U4.10(SCL) U5.2(SCK) ; port I2C_3V3_SENSOR_SCL
AP_I2C2_SDA: U3.3(SDA) U4.9(SDA) U5.4(SDI) ; port I2C_3V3_SENSOR_SDA
AP_PB1_CO2_INT: R19.1 U4.3(~{INT}) ; port CO2_INT_L
AP_PC0_CO2_WAKE_L: U4.7(~{WAKE}) ; port AP_CO2_WAKE_L
AP_PC4_PRESS_INT: U5.7(INT) ; port PRESS_INT
CO2_ADDR: R21.1 R23.2 U4.1(ADDR)
CO2_PWM: U4.4(PWM) U4.5(SENSE)
PRESS_ADDR: R20.1 R22.2 U5.5(SDO)

Not connected (* = marked no-connect by the designer): U4 8(NC)*

### Notes on the sheet
- Air Quality Sensors
- CO2 + Air Quality
- Temperature + Humidity
- I2C Device Address Format
- 7-bit address
- CO2_ADDR=0: 0x5A
- CO2_ADDR=1: 0x5B
- ENS210 Fixed I2C Address=0x43
- Barometric Pressure
- PRESS_ADDR=0: 0x76
- PRESS_ADDR=1: 0x77
- Title
- Size:
- Date:
- B
- Number:
- Time:
- Revision:
- Sheet
- of
- File:
- (in symbol CMP-536b9a7387ce8cac-9) NOSTUFF

### Library data of the parts
C21 C23 C24 = CMP-034ac9768ab0dc8d-1: as C8 on sheet STM32F4; RoHS: Compliant; Capacitance Tolerance: ±10%; OctopartID: 034ac9768ab0dc8d; Packaging: Cut Tape (CT); Octopart URL: http://octopart.com/885012206071-w%C3%BCrth+elektronik-53914780; Manufacturer Part Number: 885012206071
C22 = CMP-8856396-4: CAP CER 4.7UF 25V 10% X5R 0603; Capacitance Tolerance: ±10%; Lifecycle Status: Active; Octopart Url: https://octopart.com/grm188r61e475ke11d-murata-26982327; OctopartID: 0176c9e793a7deb1; Packaging: Cut Tape (CT); REACH SVHC Compliance: No SVHC; RoHS: Compliant; Size-Length: 0.0016 m; Size-Thickness: 0.0008 m; Size-Width: 0.0008 m; Manufacturer Part Number: GRM188R61E475KE11D
R19 = CMP-1853446-5: as R17 on sheet STM32F4; Number of Pins: 2; Size-Height: 450 µm; PackageDescription: 2-Pin Surface Mount Device, Body 1.6 x 0.8 mm; Size-Width: 800 µm; Seller Landing  Url: https://octopart-clicks.com/click/track?country=US&ak=8157f166&sig=0952a08&sid=5489&ppid=40952860&vpid=270386233&ct=offers; DatasheetVersion: Rev. 4, 02/2016; PackageReference: 0603; Size-Length: 1.60 mm; RoHS: Compliant; Mounting Style: Surface Mount; OctopartID: 2162ea18e018fea5; Manufacturer Part Number: RC0603FR-0722KL; Packaging: Cut Tape (CT), Tape & Reel (TR); Octopart Url: http://octopart.com/rc0603fr-0722kl-yageo-40952860; REACH SVHC Compliance: No SVHC
R20-R23 = CMP-536b9a7387ce8cac-9: RES SMD 0 OHM JUMPER 1/10W 0603; Manufacturer Part Number: RC0603JR-070RL; Package / Case: 0603; Size / Dimension: 0.063" L x 0.032" W (1.60mm x 0.80mm); Features: Moisture Resistant; Series: RC
U3 = CMP-d38f1e156f1a0c48-1: Humidity/Temperature Sensor Digital Serial (2-Wire, I2C) 4-Pin QFN EP T/R; Lead-Free Status: Lead Free; Octopart URL: https://octopart.com/ens210-lqfm-ams-76585459; Manufacturer Part Number: ENS210-LQFM; RoHS: Compliant; OctopartID: d38f1e156f1a0c48
U4 = CMP-1175dd4b038fceb2-3: Low Power Digital Sensor For Ind; Manufacturer Part Number: CCS811B-JOPD500
U5 = CMP-7accb6959f30a50b-7: Pressure Sensor by Bosch Sensortec; Lead-Free Status: Lead Free; OctopartID: 7accb6959f30a50b; Mounting Style: Surface Mount; Octopart URL: https://octopart.com/bmp388-bosch+tools-89374874; Manufacturer Part Number: BMP388

## Sheet Acoustic, Light, Motion Sensors.SchDoc: Acoustic, Light, & Motion Sensors
size B; Organization: Drexel University; Address1: ECE Senior Design; Address2: 2018-2019; Address3: ECE-08; Revision: 1.0; SheetNumber: 10; SheetTotal: 10
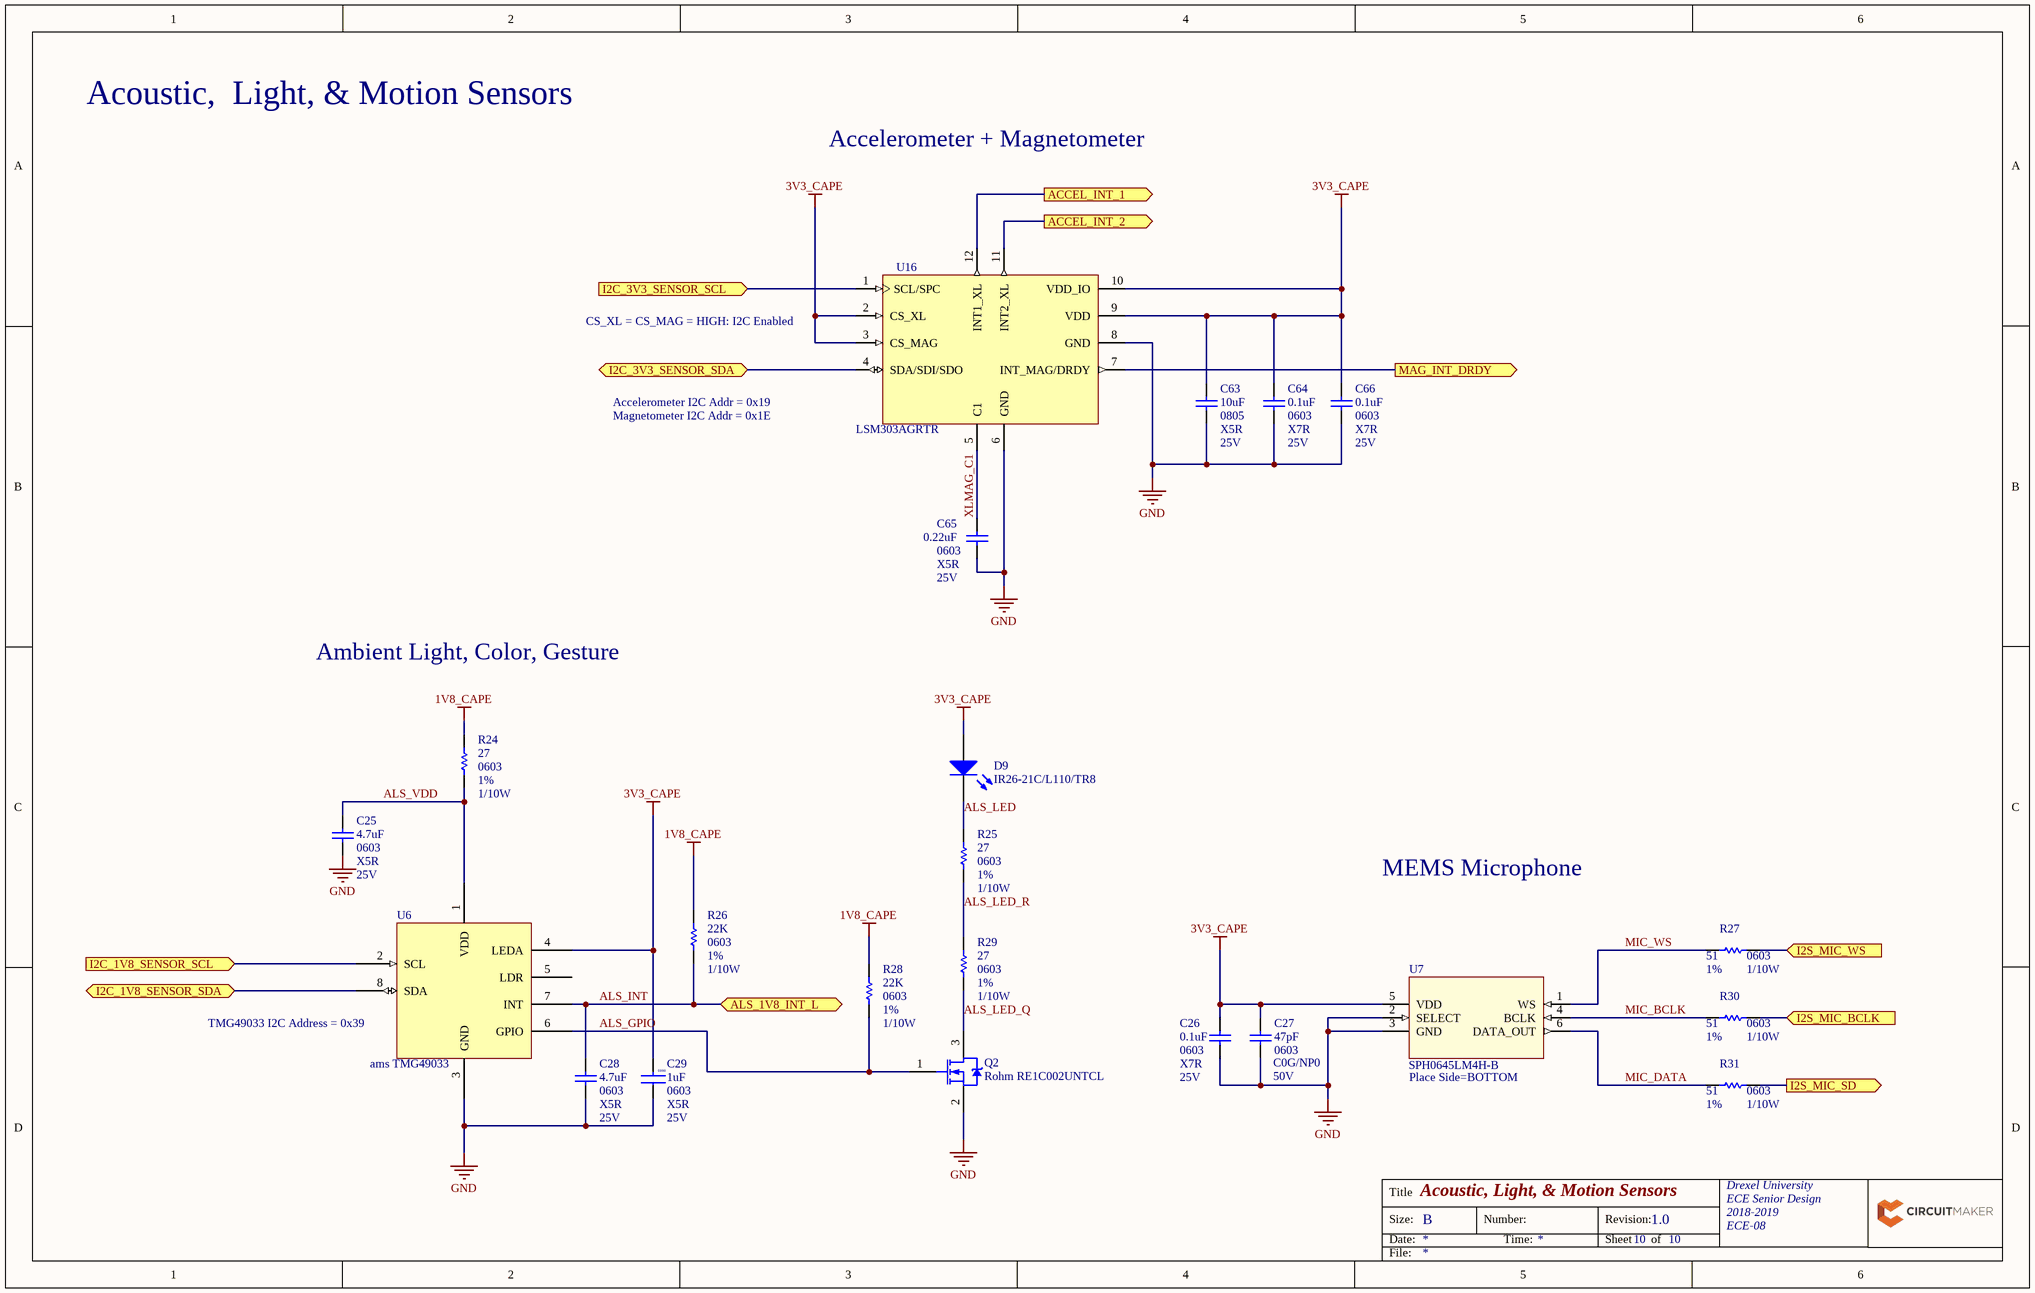
[diagram p9: Acoustic, Light, Motion Sensors.SchDoc]

### Parts
C25  Capacitance: 4.7uF  Case/Package: 0603  Dielectric Characteristic: X5R  Voltage Rating (DC): 25V  [CAPC1608X90X35ML10T15]  (hidden comment: Murata GRM188R61E475KE11D)
C26  Dielectric Characteristic: X7R  Voltage Rating (DC): 25V  Capacitance: 0.1uF  Package: 0603  [PCB-8usp83j76ntw2xroyu3n-1]  (hidden comment: Würth Elektronik 885012206071)
C27  Capacitance: 47pF  Dielectric Characteristic: C0G/NP0  Voltage Rating (DC): 50V  Package: 0603  [PCB-6hp2bdit6vqlyhs5eujf-1]  (hidden comment: Würth Elektronik 885012006055)
C28  Capacitance: 4.7uF  Case/Package: 0603  Dielectric Characteristic: X5R  Voltage Rating (DC): 25V  [CAPC1608X90X35ML10T15]  (hidden comment: Murata GRM188R61E475KE11D)
C29  Case/Package: 0603  Dielectric Characteristic: X5R  Capacitance: 1uF  Voltage Rating (DC): 25V  [PCB-bncvufzharetcg4gy1u6-1]  (hidden comment: Taiyo Yuden TMK107BJ105KA-T)
C63  Voltage Rating (DC): 25V  Package: 0805  Capacitance: 10uF  Temperature Coefficient: X5R  [Capacitor_0805]  (hidden comment: Murata GRM21BR61E106MA73L)
C64  Dielectric Characteristic: X7R  Voltage Rating (DC): 25V  Capacitance: 0.1uF  Package: 0603  [PCB-8usp83j76ntw2xroyu3n-1]  (hidden comment: Würth Elektronik 885012206071)
C65  Case/Package: 0603  Capacitance: 0.22uF  Temperature Coefficient: X5R  Voltage Rating: 25V  [PCB-eliu6zwwm13rwakn7csa-1]  (hidden comment: Würth Elektronik 885012106019)
C66  Dielectric Characteristic: X7R  Voltage Rating (DC): 25V  Capacitance: 0.1uF  Package: 0603  [PCB-8usp83j76ntw2xroyu3n-1]  (hidden comment: Würth Elektronik 885012206071)
D9  IR26-21C/L110/TR8  [1206_A]
Q2  Rohm RE1C002UNTCL  [PCB-cy8fr5d7bejv46iuepu9-1]
R24  Resistance: 27  Power Rating: 1/10W  Case/Package: 0603  Resistance Tolerance: 1%  [0603-RES]  (hidden comment: Panasonic / Panasonic ECG ERJ-3EKF27R0V)
R25  Resistance: 27  Power Rating: 1/10W  Case/Package: 0603  Resistance Tolerance: 1%  [0603-RES]  (hidden comment: Panasonic / Panasonic ECG ERJ-3EKF27R0V)
R26  Resistance: 22K  Resistance Tolerance: 1%  Case/Package: 0603  Power Rating: 1/10W  [RESC1608X55X25LL10T15]  (hidden comment: Yageo RC0603FR-0722KL)
R27  Case/Package: 0603  Power Rating: 1/10W  Resistance: 51  Resistance Tolerance: 1%  [PCB-9ahxsq8gddjqcnfjmojj-1]  (hidden comment: Stackpole Electronics RMCF0603FT51R0)
R28  Resistance: 22K  Resistance Tolerance: 1%  Case/Package: 0603  Power Rating: 1/10W  [RESC1608X55X25LL10T15]  (hidden comment: Yageo RC0603FR-0722KL)
R29  Resistance: 27  Power Rating: 1/10W  Case/Package: 0603  Resistance Tolerance: 1%  [0603-RES]  (hidden comment: Panasonic / Panasonic ECG ERJ-3EKF27R0V)
R30  Case/Package: 0603  Power Rating: 1/10W  Resistance: 51  Resistance Tolerance: 1%  [PCB-9ahxsq8gddjqcnfjmojj-1]  (hidden comment: Stackpole Electronics RMCF0603FT51R0)
R31  Case/Package: 0603  Power Rating: 1/10W  Resistance: 51  Resistance Tolerance: 1%  [PCB-9ahxsq8gddjqcnfjmojj-1]  (hidden comment: Stackpole Electronics RMCF0603FT51R0)
U6  ams TMG49033  [LGA8C102P2X4_200X500X107]
U7  Manufacturer Part Number: SPH0645LM4H-B  [SPH-MEMS]  (hidden comment: PH0645LM4H-B)
U16  LSM303AGRTR  [PCB-zxk1k6ks26krobft08qb-1]

### Ports
ACCEL_INT_1 (out), ACCEL_INT_2 (out), ALS_1V8_INT_L, I2C_1V8_SENSOR_SCL (in), I2C_1V8_SENSOR_SDA (bidir), I2C_3V3_SENSOR_SCL (in), I2C_3V3_SENSOR_SDA (bidir), I2S_MIC_BCLK (in), I2S_MIC_SD (out), I2S_MIC_WS (in), MAG_INT_DRDY (out)

### Nets
1V8_CAPE: R24.2 R26.2 R28.2
3V3_CAPE: C26.2 C27.2 C29.2 C63.2 C64.2 C66.2 D9.1 U6.4(LEDA) U7.5(VDD) U16.2(CS_XL) U16.3(CS_MAG) U16.9(VDD) U16.10(VDD_IO)
GND: C25.2 C26.1 C27.1 C28.2 C29.1 C63.1 C64.1 C65.1 C66.1 Q2.2(S) U6.3(GND) U7.2(SELECT) U7.3(GND) U16.6(GND) U16.8(GND)
ALS_GPIO: Q2.1(G) R28.1 U6.6(GPIO)
ALS_INT: C28.1 R26.1 U6.7(INT) ; port ALS_1V8_INT_L
ALS_LED: D9.2 R25.2
ALS_LED_Q: Q2.3(D) R29.1
ALS_LED_R: R25.1 R29.2
ALS_VDD: C25.1 R24.1 U6.1(VDD)
AP_I2C2_SCL: U16.1(SCL/SPC) ; port I2C_3V3_SENSOR_SCL
AP_I2C2_SDA: U16.4(SDA/SDI/SDO) ; port I2C_3V3_SENSOR_SDA
AP_I2S3_BCLK: R30.2 ; port I2S_MIC_BCLK
AP_I2S3_SD: R31.2 ; port I2S_MIC_SD
AP_I2S3_WS: R27.2 ; port I2S_MIC_WS
AP_PB14_INT_1_XL: U16.12(INT1_XL) ; port ACCEL_INT_1
AP_PB15_INT_2_XL: U16.11(INT2_XL) ; port ACCEL_INT_2
AP_PC6_INT_MAG: U16.7(INT_MAG/DRDY) ; port MAG_INT_DRDY
MIC_BCLK: R30.1 U7.4(BCLK)
MIC_DATA: R31.1 U7.6(DATA_OUT)
MIC_WS: R27.1 U7.1(WS)
RK_I2C6_SCL: U6.2(SCL) ; port I2C_1V8_SENSOR_SCL
RK_I2C6_SDA: U6.8(SDA) ; port I2C_1V8_SENSOR_SDA
XLMAG_C1: C65.2 U16.5(C1)

Not connected (* = marked no-connect by the designer): U6 5(LDR)

### Notes on the sheet
- Acoustic,  Light, & Motion Sensors
- Accelerometer + Magnetometer
- CS_XL = CS_MAG = HIGH: I2C Enabled
- Accelerometer I2C Addr = 0x19
- Magnetometer I2C Addr = 0x1E
- Ambient Light, Color, Gesture
- MEMS Microphone
- (near U6) TMG49033 I2C Address = 0x39
- (near U7) Place Side=BOTTOM
- Title
- Size:
- Date:
- B
- Number:
- Time:
- Revision:
- Sheet
- of
- File:

### Library data of the parts
C25 C28 = CMP-8856396-4: CAP CER 4.7UF 25V 10% X5R 0603; Capacitance Tolerance: ±10%; Lifecycle Status: Active; Octopart Url: https://octopart.com/grm188r61e475ke11d-murata-26982327; OctopartID: 0176c9e793a7deb1; Packaging: Cut Tape (CT); REACH SVHC Compliance: No SVHC; RoHS: Compliant; Size-Length: 0.0016 m; Size-Thickness: 0.0008 m; Size-Width: 0.0008 m; Manufacturer Part Number: GRM188R61E475KE11D
C26 C64 C66 = CMP-034ac9768ab0dc8d-1: as C8 on sheet STM32F4; RoHS: Compliant; Capacitance Tolerance: ±10%; OctopartID: 034ac9768ab0dc8d; Packaging: Cut Tape (CT); Octopart URL: http://octopart.com/885012206071-w%C3%BCrth+elektronik-53914780; Manufacturer Part Number: 885012206071
C27 = CMP-bdcf7723a1936208-1: Cap, Mlcc, Np0, 47Pf, 50V, 0603; Capacitance Tolerance: ±5%; Octopart URL: https://octopart.com/885012006055-w%C3%BCrth+elektronik-65419578; Manufacturer Part Number: 885012006055; Operating Temperature: -55.0 °C (min); Packaging: Cut Tape (CT); RoHS: Compliant; OctopartID: bdcf7723a1936208
C29 = CMP-ac4e65478e587389-1: Cap Ceramic 1uF 25V X5R 10% SMD 0603 85°C Paper T/R; Lead-Free Status: Lead Free; Octopart URL: http://octopart.com/tmk107bj105ka-t-taiyo+yuden-198512; Packaging: Cut Tape (CT); Size-Width: 800 µm; Halogen Free Status: Halogen Free; Size-Length: 1.60 mm; Capacitance Tolerance: ±10%; OctopartID: ac4e65478e587389; Size-Height: 800 µm; Mounting Style: Surface Mount; Manufacturer Part Number: TMK107BJ105KA-T; Lifecycle Status: Active; Number of Pins: 2; RoHS: Compliant
C63 = CMP-3dadf66f6462e26a-3: 0805 25 V 10 uF ±20% Tolerance X5R Multilayer Ceramic Capacitor; Case/Package (SI): 2012; Size-Length: 2.00 mm; OctopartID: 3dadf66f6462e26a; RoHS: Compliant; Lifecycle Status: Active
C65 = CMP-d2ee18d25bec0d29-1: Cap Cer 0.22UF 25V X5R 0603; Capacitance Tolerance: ±20%; Manufacturer Part No.: 885012106019; Octopart URL: https://octopart.com/885012106019-w%C3%BCrth+elektronik-53914724; Manufacturer Part Number: 885012106019; Mounting Style: Surface Mount; Packaging: Tape & Reel (TR); OctopartID: d2ee18d25bec0d29
D9 = CMP-1542916-2: LED IR SUBMINI 1.6MM ROUND SMD; Lead-Free Status: Lead Free; Manufacturer Part Number: IR26-21C/L110/TR8; Octopart Url: https://octopart.com/ir26-21c%2Fl110%2Ftr8-everlight-18582662; OctopartID: 43218b30eac19ce6; RoHS: Compliant
Q2 = CMP-817649b5405f5eb1-2: MOSFET N-CH 20V 0.2A EMT3; Manufacturer: Rohm Semiconductor; Vendor Part Number: RE1C002UNTCLCT-ND; Cost Vendor: 0.181 per 10; FET Type: MOSFET N-Channel, Metal Oxide; Lead-Free Status: Lead Free; Vendor: Digikey; Current - Continuous Drain (Id) @ 25°C: 200mA (Ta); FET Feature: Logic Level Gate, 1.2V Drive; OctopartID: 817649b5405f5eb1; Octopart URL: http://octopart.com/re1c002untcl-rohm-30008399; Drain to Source Voltage (Vdss): 20V; Cost: 0.20; Package / Case: SC-75, SOT-416; Manufacturer Part Number: RE1C002UNTCL; RoHS: Compliant
R24 R25 R29 = CMP-f61f3f990ffb29d8-2: Res Thick Film 0603 27 Ohm 1% 0.1W(1/10W) ±100ppm/C Molded SMD Automotive Punched T/R; Lead-Free Status: Lead Free; Voltage Rating (DC): 75.0 V; Manufacturer Part Number: ERJ-3EKF27R0V; RoHS: Compliant; OctopartID: f61f3f990ffb29d8; Number of Pins: 2; Mounting Style: Surface Mount; Seller Landing  Url: https://octopart-clicks.com/click/track?country=US&ak=8157f166&sig=00bb2fd&sid=459&ppid=9231490&vpid=115259536&ct=offers; Lifecycle Status: Not Listed by Manufacturer; Octopart Url: http://octopart.com/erj-3ekf27r0v-panasonic-9231490; REACH SVHC Compliance: No SVHC; Packaging: Tape & Reel (TR), Cut Tape (CT)
R26 R28 = CMP-1853446-5: as R17 on sheet STM32F4; Number of Pins: 2; Size-Height: 450 µm; PackageDescription: 2-Pin Surface Mount Device, Body 1.6 x 0.8 mm; Size-Width: 800 µm; Seller Landing  Url: https://octopart-clicks.com/click/track?country=US&ak=8157f166&sig=0952a08&sid=5489&ppid=40952860&vpid=270386233&ct=offers; DatasheetVersion: Rev. 4, 02/2016; PackageReference: 0603; Size-Length: 1.60 mm; RoHS: Compliant; Mounting Style: Surface Mount; OctopartID: 2162ea18e018fea5; Manufacturer Part Number: RC0603FR-0722KL; Packaging: Cut Tape (CT), Tape & Reel (TR); Octopart Url: http://octopart.com/rc0603fr-0722kl-yageo-40952860; REACH SVHC Compliance: No SVHC
R27 R30 R31 = CMP-c18a09a5cf0a1e4d-2: Res Thick Film 0603 51 Ohm 1% 0.1W(1/10W) ???}100ppm/??? Molded SMD Automotive Paper T/R; Lead-Free Status: Lead Free; Mounting Style: Surface Mount; RoHS: Compliant; Packaging: Tape & Reel (TR); Manufacturer Part Number: RMCF0603FT51R0; OctopartID: c18a09a5cf0a1e4d; Octopart URL: https://octopart.com/rmcf0603ft51r0-stackpole+electronics-19213286
U6 = CMP-5d86977545368241-2: Gesture, Color and Proximity Sensor Module Digital Output 1.8V 8-Pin T/R
U7 = CMP-f6813c2c61792946-5: Mic Mems Digital I2s Omni -26db; OctopartID: f6813c2c61792946
U16 = CMP-98f6527696964731-3: Ultra-compact high-performance eCompass module: ultra-low power 3D accelerometer and 3D magnetometer; Lifecycle Status: Active; Octopart URL: http://octopart.com/lsm303agrtr-stmicroelectronics-59386630; Manufacturer Part Number: LSM303AGRTR; Packaging: Cut Tape (CT); RoHS: Compliant

## Nets that join several sheets
1V8_CAPE: Debug & Test Points (J5.4 TP14.1), IO Level Shifters (C61.1 R63.2 R64.2 U15.2), DC-DC Converters (C52.2 U12.5), Acoustic, Light, Motion Sensors (R24.2 R26.2 R28.2)
1V8_RK: Board Connectors (J1.36), Debug & Test Points (R45.2 R50.2), IO Level Shifters (C59.1 U14.2)
3V3_CAPE: Debug & Test Points (5 pins), IO Level Shifters (7 pins), USB to UART Bridge (D12.1 D13.2), USB Type C Power Controller (5 pins), DC-DC Converters (10 pins), STM32F4 (16 pins), Air Quality Sensors (13 pins), Acoustic, Light, Motion Sensors (13 pins)
5V_DBG: Board Connectors (J2.1), Debug & Test Points (TP9.1), USB to UART Bridge (C53.2 FB1.1)
12V_CAPE: Debug & Test Points (J5.3 TP7.1), DC-DC Converters (7 pins)
12V_RK: Board Connectors (J1.35 J1.37), Debug & Test Points (J5.5 R43.2 TP6.1), DC-DC Converters (7 pins)
GND: Cape Overview (MH1.1 MH2.1 MH3.1 MH4.1), Board Connectors (36 pins), Debug & Test Points (16 pins), IO Level Shifters (6 pins), USB to UART Bridge (8 pins), USB Type C Power Controller (11 pins), DC-DC Converters (34 pins), STM32F4 (24 pins), Air Quality Sensors (12 pins), Acoustic, Light, Motion Sensors (15 pins)
VBUS_USB_PD: Board Connectors (6 pins), Debug & Test Points (TP2.1), USB Type C Power Controller (6 pins)
VCC_PD: Debug & Test Points (J5.1 R42.2 TP3.1), USB Type C Power Controller (7 pins), DC-DC Converters (C31.2 C32.2 C33.2 U8.2)
ALS_INT: IO Level Shifters (U15.5), Acoustic, Light, Motion Sensors (C28.1 R26.1 U6.7)
AP_BOOT0_SEL: Debug & Test Points (SW2.7), STM32F4 (U2.60)
AP_I2C1_SCL: Debug & Test Points (J5.6 TP24.1), IO Level Shifters (R58.1 U14.14), USB Type C Power Controller (U1.7), STM32F4 (U2.58)
AP_I2C1_SDA: Debug & Test Points (J5.8 TP26.1), IO Level Shifters (R57.1 U14.13), USB Type C Power Controller (U1.8), STM32F4 (U2.59)
AP_I2C2_SCL: Debug & Test Points (TP25.1), IO Level Shifters (R60.1 U15.22), STM32F4 (U2.29), Air Quality Sensors (U3.2 U4.10 U5.2), Acoustic, Light, Motion Sensors (U16.1)
AP_I2C2_SDA: Debug & Test Points (TP27.1), IO Level Shifters (R59.1 U15.21), STM32F4 (U2.62), Air Quality Sensors (U3.3 U4.9 U5.4), Acoustic, Light, Motion Sensors (U16.4)
AP_I2S3_BCLK: STM32F4 (U2.51), Acoustic, Light, Motion Sensors (R30.2)
AP_I2S3_SD: STM32F4 (U2.53), Acoustic, Light, Motion Sensors (R31.2)
AP_I2S3_WS: STM32F4 (U2.20), Acoustic, Light, Motion Sensors (R27.2)
AP_PA5_ADC1_5: DC-DC Converters (U9.6), STM32F4 (U2.21)
AP_PA8_RK_GPIO: IO Level Shifters (U15.19), STM32F4 (U2.41)
AP_PB1_ADC1_9: DC-DC Converters (U11.6), STM32F4 (U2.27)
AP_PB1_CO2_INT: Debug & Test Points (TP12.1), STM32F4 (U2.26), Air Quality Sensors (R19.1 U4.3)
AP_PB4_PD_ATTACH: Debug & Test Points (TP8.1), USB Type C Power Controller (R9.1 U1.11), STM32F4 (U2.56)
AP_PB5_PD_I2C_ALERT: USB Type C Power Controller (R8.1 U1.19), STM32F4 (U2.57)
AP_PB8_PD_GPIO: Debug & Test Points (TP5.1), USB Type C Power Controller (R10.1 U1.15), STM32F4 (U2.61)
AP_PB14_INT_1_XL: STM32F4 (U2.35), Acoustic, Light, Motion Sensors (U16.12)
AP_PB15_INT_2_XL: STM32F4 (U2.36), Acoustic, Light, Motion Sensors (U16.11)
AP_PC0_CO2_WAKE_L: Debug & Test Points (TP10.1), STM32F4 (U2.8), Air Quality Sensors (U4.7)
AP_PC1_ALS_INT_L: Debug & Test Points (TP15.1), IO Level Shifters (R65.1 U15.20), STM32F4 (U2.9)
AP_PC4_PRESS_INT: Debug & Test Points (TP13.1), STM32F4 (U2.24), Air Quality Sensors (U5.7)
AP_PC6_INT_MAG: STM32F4 (U2.37), Acoustic, Light, Motion Sensors (U16.7)
AP_PC8: Debug & Test Points (J5.18), STM32F4 (U2.39)
AP_RESET_HDR: Debug & Test Points (J6.4), STM32F4 (R18.2)
AP_SPI1_MISO: Debug & Test Points (TP21.1), IO Level Shifters (U14.16), STM32F4 (U2.22)
AP_SPI1_MOSI: Debug & Test Points (TP23.1), IO Level Shifters (U14.15), STM32F4 (U2.23)
AP_SPI1_SCK: Debug & Test Points (TP20.1), IO Level Shifters (U14.17), STM32F4 (U2.55)
AP_SPI1_SLAVE_NSS: Debug & Test Points (TP22.1), IO Level Shifters (U14.18), STM32F4 (U2.50)
AP_SPI2_MISO: Debug & Test Points (J5.14), STM32F4 (U2.10)
AP_SPI2_MOSI: Debug & Test Points (J5.12), STM32F4 (U2.11)
AP_SPI2_MSTR_NSS: Debug & Test Points (J5.16), STM32F4 (U2.33)
AP_SPI2_SCK: Debug & Test Points (J5.10), STM32F4 (U2.34)
AP_SWCLK: Debug & Test Points (J6.2), STM32F4 (U2.49)
AP_SWDIO: Debug & Test Points (J6.3), STM32F4 (U2.46)
AP_UART1_CTS: USB to UART Bridge (U13.2), STM32F4 (U2.44)
AP_UART1_RTS: USB to UART Bridge (U13.6), STM32F4 (U2.45)
AP_UART1_RX: Debug & Test Points (TP29.1), USB to UART Bridge (U13.1), STM32F4 (U2.43)
AP_UART1_TX: Debug & Test Points (TP28.1), USB to UART Bridge (U13.4), STM32F4 (U2.42)
AP_UART2_CTS: Debug & Test Points (TP18.1), IO Level Shifters (U14.21), STM32F4 (U2.14)
AP_UART2_RTS: Debug & Test Points (TP16.1), IO Level Shifters (U14.22), STM32F4 (U2.15)
AP_UART2_RX: Debug & Test Points (TP17.1), IO Level Shifters (U14.20), STM32F4 (U2.17)
AP_UART2_TX: Debug & Test Points (TP19.1), IO Level Shifters (U14.19), STM32F4 (U2.16)
HV_BUCK_EN: Debug & Test Points (SW2.3), DC-DC Converters (U8.7)
LV_BUCK_EN: Debug & Test Points (SW2.5), DC-DC Converters (U10.1)
PD_RESET: Debug & Test Points (SW2.1), USB Type C Power Controller (U1.6)
RK_GPIO0_A2: Board Connectors (J1.23), Debug & Test Points (R45.1 SW3.1 SW3.2)
RK_GPIO0_A6: Board Connectors (J1.24), IO Level Shifters (U15.6)
RK_GPIO1_B2: Board Connectors (J1.25), Debug & Test Points (R50.1 SW5.1)
RK_I2C1_SCL: Board Connectors (J1.20), IO Level Shifters (U14.11)
RK_I2C1_SDA: Board Connectors (J1.22), IO Level Shifters (U14.12)
RK_I2C6_SCL: Board Connectors (J1.16), IO Level Shifters (R64.1 U15.3), Acoustic, Light, Motion Sensors (U6.2)
RK_I2C6_SDA: Board Connectors (J1.18), IO Level Shifters (R63.1 U15.4), Acoustic, Light, Motion Sensors (U6.8)
RK_I2C7_SCL: Board Connectors (J3.35), Debug & Test Points (J5.7)
RK_I2C7_SDA: Board Connectors (J3.37), Debug & Test Points (J5.9)
RK_RESET: Board Connectors (J1.5), Debug & Test Points (SW4.1 SW4.2)
RK_SPI0_CLK: Board Connectors (J1.7), IO Level Shifters (U14.8)
RK_SPI0_CS: Board Connectors (J1.11), IO Level Shifters (U14.7)
RK_SPI0_MISO: Board Connectors (J1.9), IO Level Shifters (U14.9)
RK_SPI0_MOSI: Board Connectors (J1.13), IO Level Shifters (U14.10)
RK_SPI4_CLK: Board Connectors (J3.10), Debug & Test Points (J5.11)
RK_SPI4_CS: Board Connectors (J3.8), Debug & Test Points (J5.17)
RK_SPI4_MISO: Board Connectors (J3.12), Debug & Test Points (J5.15)
RK_SPI4_MOSI: Board Connectors (J3.2), Debug & Test Points (J5.13)
RK_UART3_CTS: Board Connectors (J1.4), IO Level Shifters (U14.3)
RK_UART3_RTS: Board Connectors (J1.10), IO Level Shifters (U14.4)
RK_UART3_RX: Board Connectors (J1.8), IO Level Shifters (U14.6)
RK_UART3_TX: Board Connectors (J1.6), IO Level Shifters (U14.5)
USB_MICRO_D_N: Board Connectors (D1.1 J2.2), USB to UART Bridge (C56.2 R51.1)
USB_MICRO_D_P: Board Connectors (D1.2 J2.3), USB to UART Bridge (C57.2 R52.1)
USBC_CC1: Board Connectors (J4.A5), Debug & Test Points (TP1.1), USB Type C Power Controller (D5.1 U1.1 U1.2)
USBC_CC2: Board Connectors (J4.B5), Debug & Test Points (TP4.1), USB Type C Power Controller (D5.2 U1.4 U1.5)